# EAGLE design CFT-PB2-smd-revC (EAGLE 5.11)
DRAWN_BY: Alexios; PROJECT_NAME: CFT Mini-Computer; REVISION: Rev B; SHEET_DESCRIPTION: Address Register, Address Bus Drivers & Termination, Autoindex Logic, Device Decoder; SIMULATION_FILENAME: addressing.v; URL: http://www.bedroomlan.org/cft

## Sheet 1 of 6
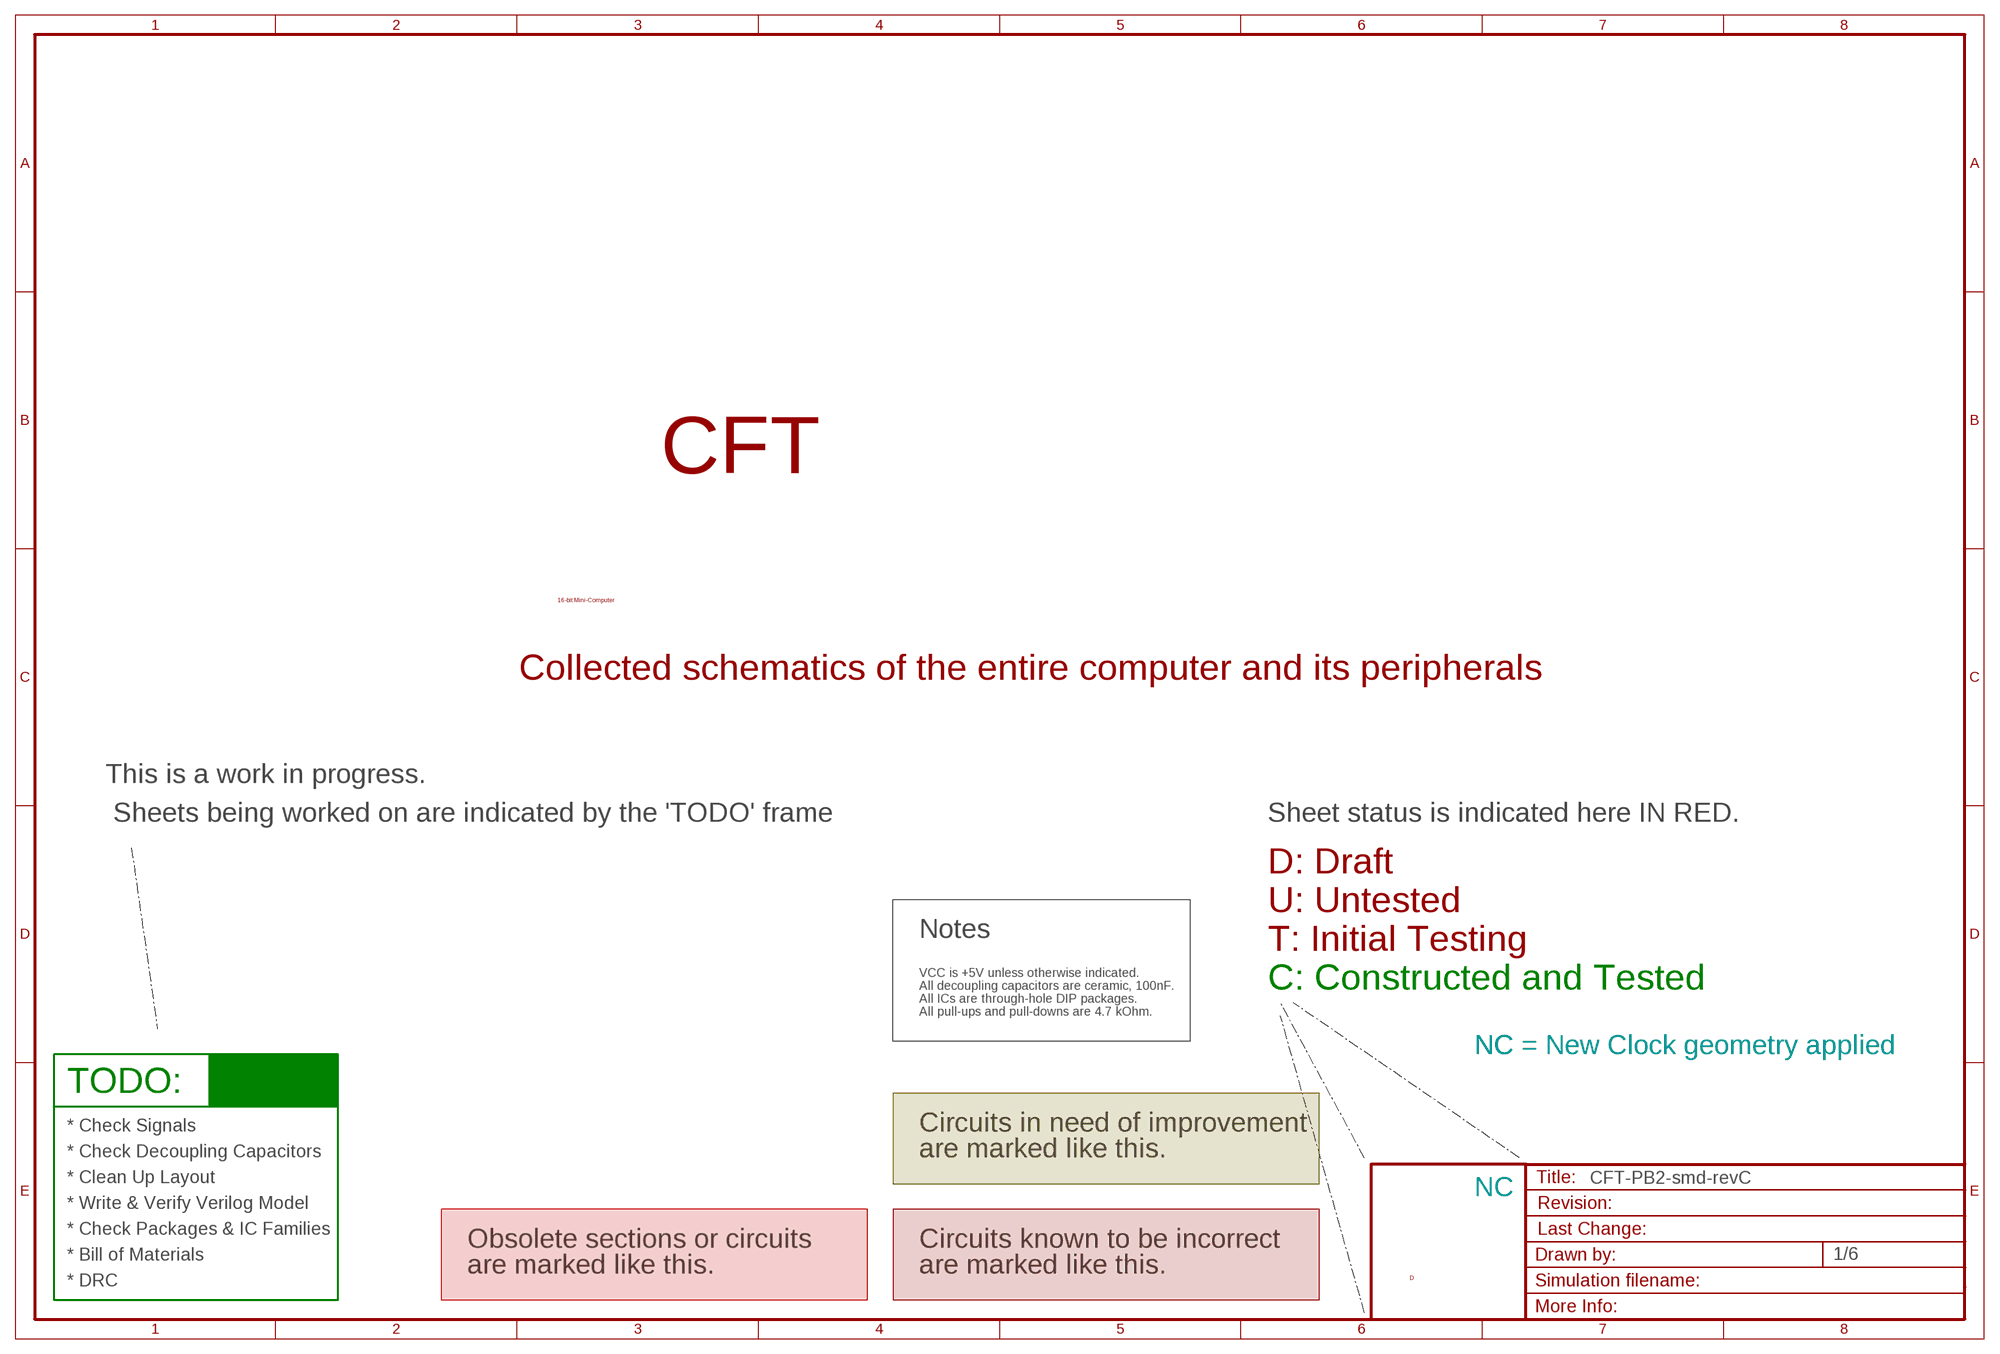
[diagram p0: schematic, sheet 1]

### Notes on the sheet
- CFT
- 16-bit Mini-Computer
- Collected schematics of the entire computer and its peripherals
- This is a work in progress.
- Sheets being worked on are indicated by the 'TODO' frame | Sheet status is indicated here IN RED.
- D: Draft
- U: Untested
- Notes
- T: Initial Testing
- VCC is +5V unless otherwise indicated.
- All decoupling capacitors are ceramic, 100nF. | C: Constructed and Tested
- All ICs are through-hole DIP packages.
- All pull-ups and pull-downs are 4.7 kOhm.
- NC | NC = New Clock geometry applied
- TODO:
- * Check Signals | Circuits in need of improvement
- * Check Decoupling Capacitors | are marked like this.
- * Clean Up Layout
- NC
- * Write & Verify Verilog Model
- * Check Packages & IC Families
- Obsolete sections or circuits | Circuits known to be incorrect
- * Bill of Materials
- are marked like this. | are marked like this.
- D
- * DRC

## Sheet 2 of 6
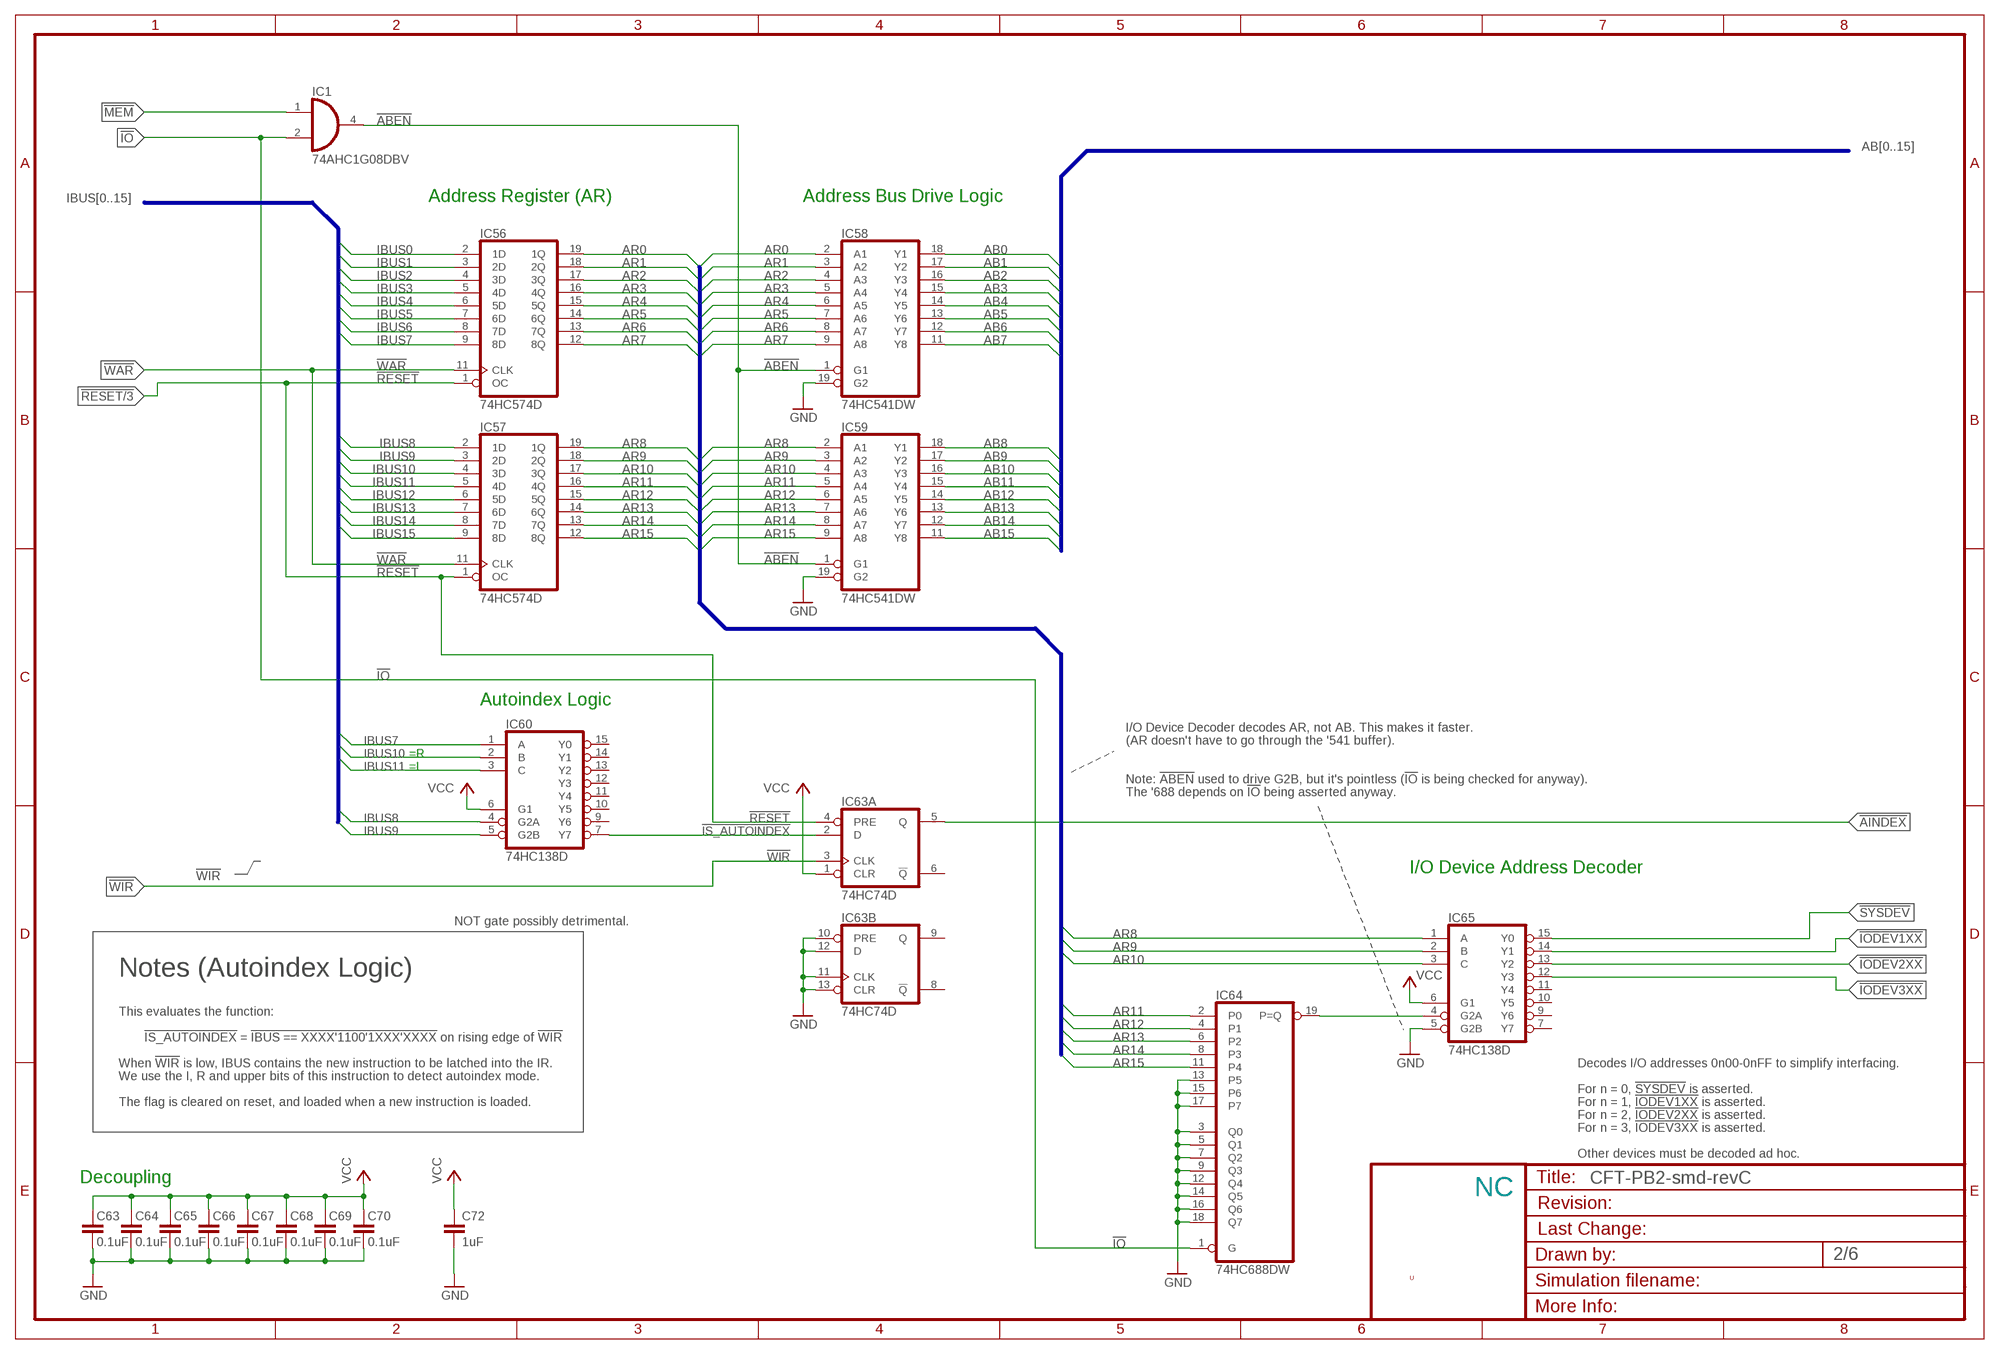
[diagram p1: schematic, sheet 2]

### Parts
C63  0.1uF  C-EUC0805K  [C0805K]
C64  0.1uF  C-EUC0805K  [C0805K]
C65  0.1uF  C-EUC0805K  [C0805K]
C66  0.1uF  C-EUC0805K  [C0805K]
C67  0.1uF  C-EUC0805K  [C0805K]
C68  0.1uF  C-EUC0805K  [C0805K]
C69  0.1uF  C-EUC0805K  [C0805K]
C70  0.1uF  C-EUC0805K  [C0805K]
C72  1uF  C-EUC0805K  [C0805K]
IC1  74AHC1G08DBV  [SOT23-5]
IC56  74HC574D  [SO20W]
IC57  74HC574D  [SO20W]
IC58  74HC541DW  [SO20W]
IC59  74HC541DW  [SO20W]
IC60  74HC138D  [SO16]
IC63  74HC74D  [SO14]
IC64  74HC688DW  [SO20W]
IC65  74HC138D  [SO16]

### Nets
!ABEN: IC1.4(O) IC58.1(G1) IC59.1(G1)
!AINDEX: IC63.5(A:Q)
!IO: IC1.2(I1) IC64.1(G) ; also sheet 6
!IODEV1XX: IC65.14(Y1) ; also sheet 6
!IODEV2XX: IC65.13(Y2) ; also sheet 6
!IODEV3XX: IC65.12(Y3) ; also sheet 6
!IS_AUTOINDEX: IC60.7(Y7) IC63.2(A:D)
!MEM: IC1.1(I0) ; also sheet 6
!RESET: IC56.1(OC) IC57.1(OC) IC63.4(A:PRE) ; also sheet 3,6
!SYSDEV: IC65.15(Y0) ; also sheet 6
!WAR: IC56.11(CLK) IC57.11(CLK) ; also sheet 6
!WIR: IC63.3(A:CLK)
AB0: IC58.18(Y1) ; also sheet 6
AB1: IC58.17(Y2) ; also sheet 6
AB2: IC58.16(Y3) ; also sheet 6
AB3: IC58.15(Y4) ; also sheet 6
AB4: IC58.14(Y5) ; also sheet 6
AB5: IC58.13(Y6) ; also sheet 6
AB6: IC58.12(Y7) ; also sheet 6
AB7: IC58.11(Y8) ; also sheet 6
AB8: IC59.18(Y1) ; also sheet 6
AB9: IC59.17(Y2) ; also sheet 6
AB10: IC59.16(Y3) ; also sheet 6
AB11: IC59.15(Y4) ; also sheet 6
AB12: IC59.14(Y5) ; also sheet 6
AB13: IC59.13(Y6) ; also sheet 6
AB14: IC59.12(Y7) ; also sheet 6
AB15: IC59.11(Y8) ; also sheet 6
AR0: IC56.19(1Q) IC58.2(A1)
AR1: IC56.18(2Q) IC58.3(A2)
AR2: IC56.17(3Q) IC58.4(A3)
AR3: IC56.16(4Q) IC58.5(A4)
AR4: IC56.15(5Q) IC58.6(A5)
AR5: IC56.14(6Q) IC58.7(A6)
AR6: IC56.13(7Q) IC58.8(A7)
AR7: IC56.12(8Q) IC58.9(A8)
AR8: IC57.19(1Q) IC59.2(A1) IC65.1(A)
AR9: IC57.18(2Q) IC59.3(A2) IC65.2(B)
AR10: IC57.17(3Q) IC59.4(A3) IC65.3(C)
AR11: IC57.16(4Q) IC59.5(A4) IC64.2(P0)
AR12: IC57.15(5Q) IC59.6(A5) IC64.4(P1)
AR13: IC57.14(6Q) IC59.7(A6) IC64.6(P2)
AR14: IC57.13(7Q) IC59.8(A7) IC64.8(P3)
AR15: IC57.12(8Q) IC59.9(A8) IC64.11(P4)
GND [low power]: C63.1 C64.1 C65.1 C66.1 C67.1 C68.1 C69.1 C70.1 C72.2 IC58.19(G2) IC59.19(G2) IC63.10(B:PRE) IC63.11(B:CLK) IC63.12(B:D) IC63.13(B:CLR) IC64.3(Q0) IC64.5(Q1) IC64.7(Q2) IC64.9(Q3) IC64.12(Q4) IC64.13(P5) IC64.14(Q5) IC64.15(P6) IC64.16(Q6) IC64.17(P7) IC64.18(Q7) IC65.5(G2B) ; also sheet 3,4,5,6
IBUS0: IC56.2(1D) ; also sheet 3,4,5,6
IBUS1: IC56.3(2D) ; also sheet 3,4,5,6
IBUS2: IC56.4(3D) ; also sheet 3,4,5,6
IBUS3: IC56.5(4D) ; also sheet 3,4,5,6
IBUS4: IC56.6(5D) ; also sheet 3,4,5,6
IBUS5: IC56.7(6D) ; also sheet 3,4,5,6
IBUS6: IC56.8(7D) ; also sheet 3,4,5,6
IBUS7: IC56.9(8D) IC60.1(A) ; also sheet 3,4,5,6
IBUS8: IC57.2(1D) IC60.4(G2A) ; also sheet 3,4,5,6
IBUS9: IC57.3(2D) IC60.5(G2B) ; also sheet 3,4,5,6
IBUS10: IC57.4(3D) IC60.2(B) ; also sheet 3,4,5,6
IBUS11: IC57.5(4D) IC60.3(C) ; also sheet 3,4,5,6
IBUS12: IC57.6(5D) ; also sheet 3,4,5,6
IBUS13: IC57.7(6D) ; also sheet 3,4,5,6
IBUS14: IC57.8(7D) ; also sheet 3,4,5,6
IBUS15: IC57.9(8D) ; also sheet 3,4,5,6
N$95: IC64.19(P=Q) IC65.4(G2A)
VCC [low power]: C63.2 C64.2 C65.2 C66.2 C67.2 C68.2 C69.2 C70.2 C72.1 IC60.6(G1) IC63.1(A:CLR) IC65.6(G1) ; also sheet 3,4,5,6
Unconnected: IC60.9(Y6) IC60.10(Y5) IC60.11(Y4) IC60.12(Y3) IC60.13(Y2) IC60.14(Y1) IC60.15(Y0) IC63.6(A:!Q) IC63.8(B:!Q) IC63.9(B:Q) IC65.7(Y7) IC65.9(Y6) IC65.10(Y5) IC65.11(Y4)

### Buses
AR[0..15]
IBUS[0..15]
AB[0..15]

### Notes on the sheet
- Address Register (AR) | Address Bus Drive Logic
- Autoindex Logic
- I/O Device Decoder decodes AR, not AB. This makes it faster.
- (AR doesn't have to go through the '541 buffer).
- =R
- =I
- Note: !ABEN! used to drive G2B, but it's pointless (!IO! is being checked for anyway).
- The '688 depends on !IO! being asserted anyway.
- I/O Device Address Decoder
- NOT gate possibly detrimental.
- Notes (Autoindex Logic)
- This evaluates the function:
- !IS_AUTOINDEX! = !IBUS == XXXX'1100'1XXX'XXXX! on rising edge of !WIR!
- When !WIR! is low, IBUS contains the new instruction to be latched into the IR. | Decodes I/O addresses 0n00-0nFF to simplify interfacing.
- We use the I, R and upper bits of this instruction to detect autoindex mode.
- For n = 0, !SYSDEV! is asserted.
- The flag is cleared on reset, and loaded when a new instruction is loaded. | For n = 1, !IODEV1XX! is asserted.
- For n = 2, !IODEV2XX! is asserted.
- For n = 3, !IODEV3XX! is asserted.
- Other devices must be decoded ad hoc.
- Decoupling
- NC
- U

## Sheet 3 of 6
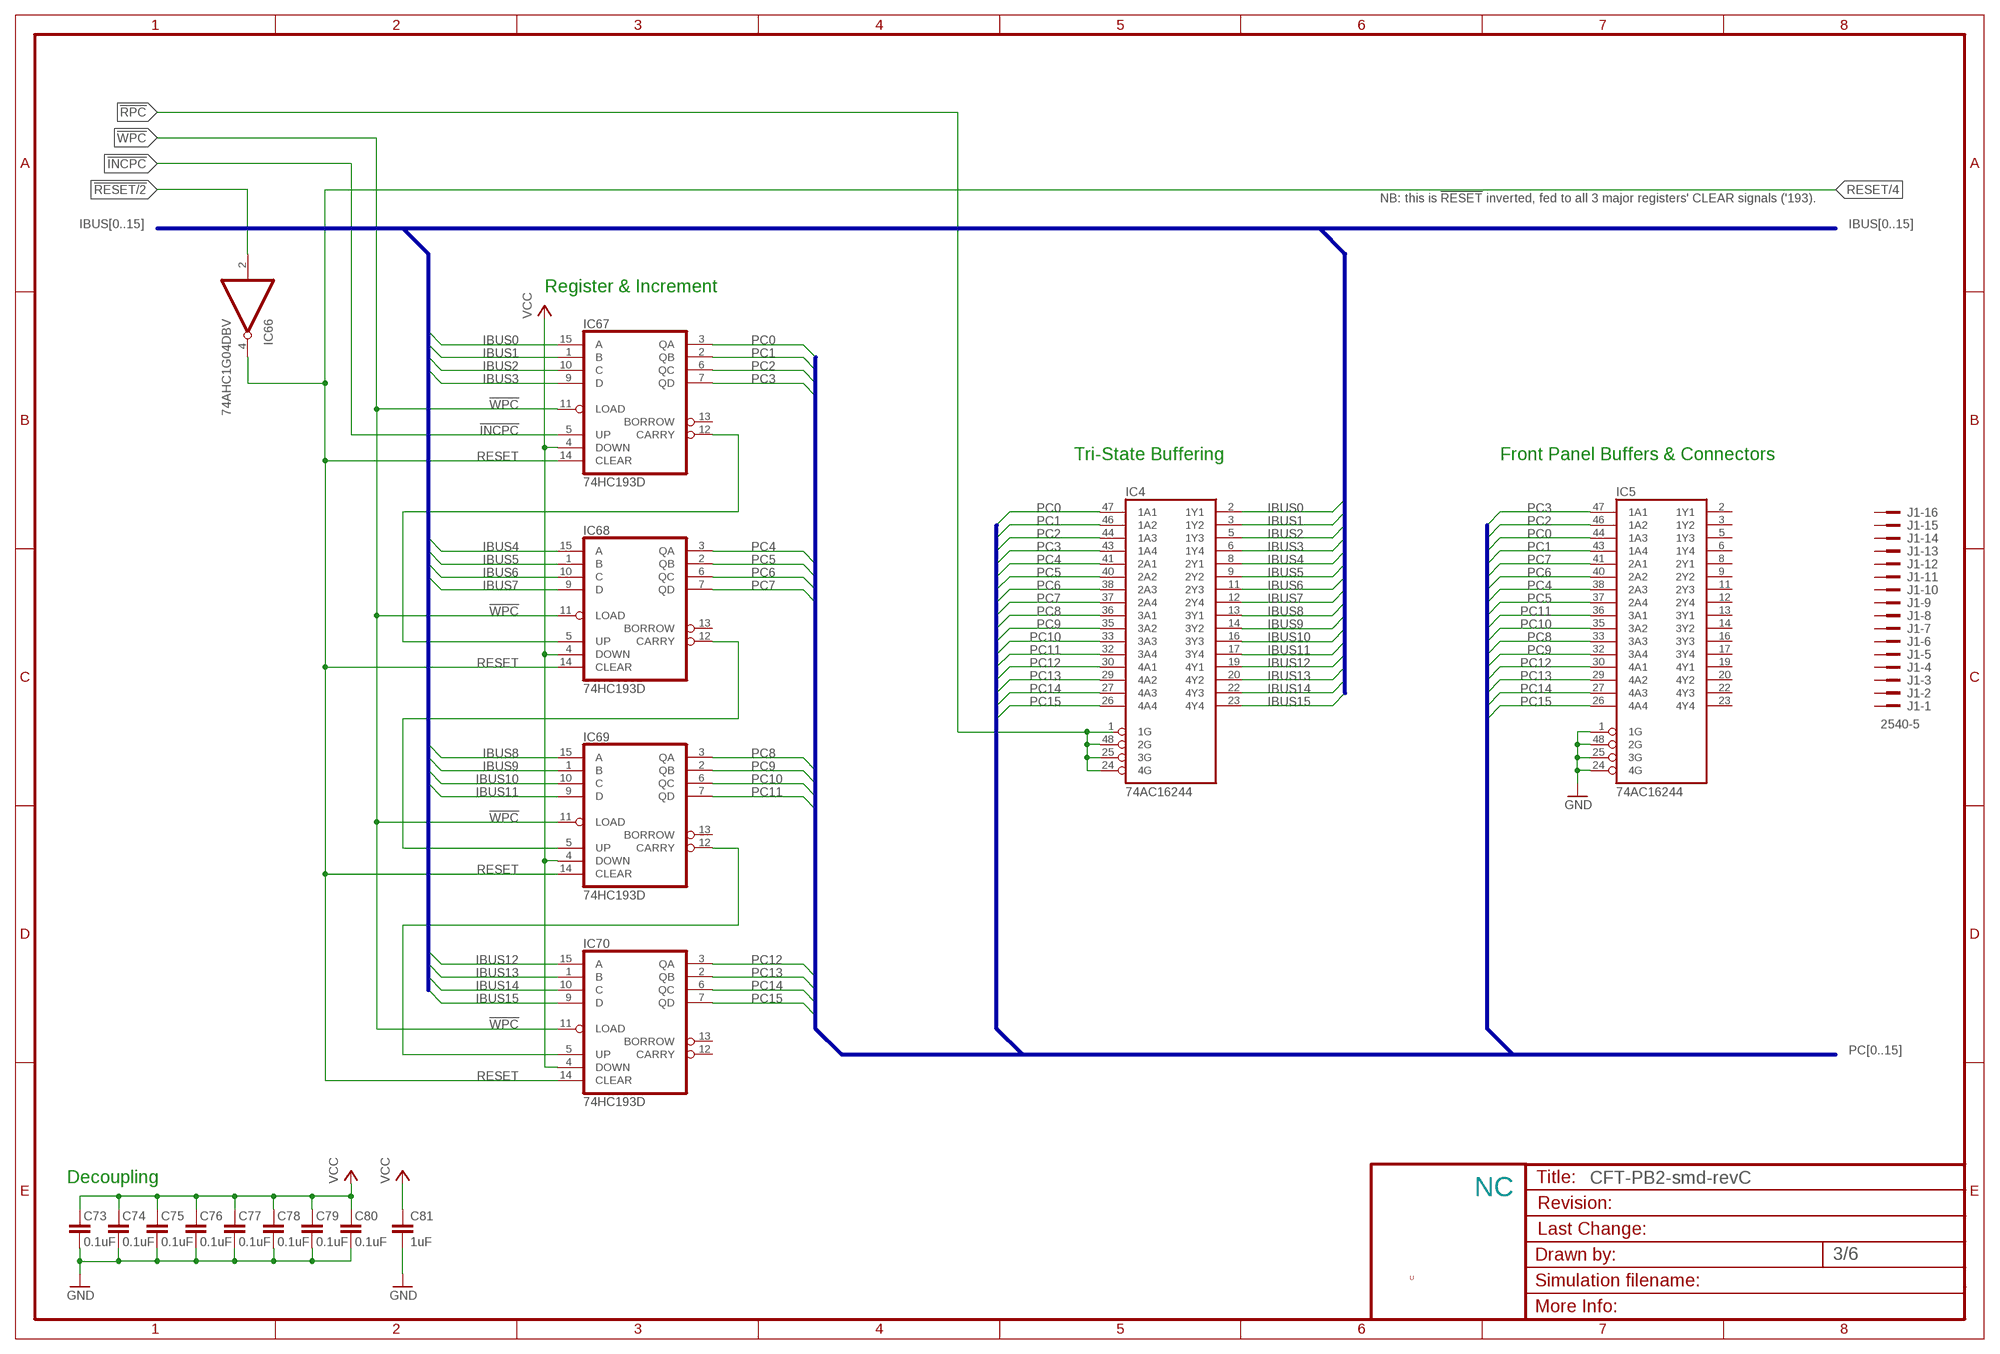
[diagram p2: schematic, sheet 3]

### Parts
C73  0.1uF  C-EUC0805K  [C0805K]
C74  0.1uF  C-EUC0805K  [C0805K]
C75  0.1uF  C-EUC0805K  [C0805K]
C76  0.1uF  C-EUC0805K  [C0805K]
C77  0.1uF  C-EUC0805K  [C0805K]
C78  0.1uF  C-EUC0805K  [C0805K]
C79  0.1uF  C-EUC0805K  [C0805K]
C80  0.1uF  C-EUC0805K  [C0805K]
C81  1uF  C-EUC0805K  [C0805K]
IC4  74AC16244  [SSOP48DL]
IC5  74AC16244  [SSOP48DL]
IC66  74AHC1G04DBV  [SOT23-5]
IC67  74HC193D  [SO16D]
IC68  74HC193D  [SO16D]
IC69  74HC193D  [SO16D]
IC70  74HC193D  [SO16D]
J1  2540-5  [PAK100/2500-5-40]

### Nets
!INCPC: IC67.5(UP) ; also sheet 6
!RESET: IC66.2(I) ; also sheet 2,6
!RPC: IC4.24(4G) IC4.25(3G) IC4.48(2G) ; also sheet 6
!WPC: IC67.11(LOAD) IC68.11(LOAD) IC69.11(LOAD) IC70.11(LOAD) ; also sheet 6
GND [low power]: C73.1 C74.1 C75.1 C76.1 C77.1 C78.1 C79.1 C80.1 C81.2 IC5.1(1G) IC5.24(4G) IC5.25(3G) IC5.48(2G) ; also sheet 2,4,5,6
IBUS0: IC4.2(1Y1) IC67.15(A) ; also sheet 2,4,5,6
IBUS1: IC4.3(1Y2) IC67.1(B) ; also sheet 2,4,5,6
IBUS2: IC4.5(1Y3) IC67.10(C) ; also sheet 2,4,5,6
IBUS3: IC4.6(1Y4) IC67.9(D) ; also sheet 2,4,5,6
IBUS4: IC4.8(2Y1) IC68.15(A) ; also sheet 2,4,5,6
IBUS5: IC4.9(2Y2) IC68.1(B) ; also sheet 2,4,5,6
IBUS6: IC4.11(2Y3) IC68.10(C) ; also sheet 2,4,5,6
IBUS7: IC4.12(2Y4) IC68.9(D) ; also sheet 2,4,5,6
IBUS8: IC4.13(3Y1) IC69.15(A) ; also sheet 2,4,5,6
IBUS9: IC4.14(3Y2) IC69.1(B) ; also sheet 2,4,5,6
IBUS10: IC4.16(3Y3) IC69.10(C) ; also sheet 2,4,5,6
IBUS11: IC4.17(3Y4) IC69.9(D) ; also sheet 2,4,5,6
IBUS12: IC4.19(4Y1) IC70.15(A) ; also sheet 2,4,5,6
IBUS13: IC4.20(4Y2) IC70.1(B) ; also sheet 2,4,5,6
IBUS14: IC4.22(4Y3) IC70.10(C) ; also sheet 2,4,5,6
IBUS15: IC4.23(4Y4) IC70.9(D) ; also sheet 2,4,5,6
N$70: IC67.12(CARRY) IC68.5(UP)
N$71: IC68.12(CARRY) IC69.5(UP)
N$734: IC69.12(CARRY) IC70.5(UP)
PC0: IC4.47(1A1) IC5.44(1A3) IC67.3(QA)
PC1: IC4.46(1A2) IC5.43(1A4) IC67.2(QB)
PC2: IC4.44(1A3) IC5.46(1A2) IC67.6(QC)
PC3: IC4.43(1A4) IC5.47(1A1) IC67.7(QD)
PC4: IC4.41(2A1) IC5.38(2A3) IC68.3(QA)
PC5: IC4.40(2A2) IC5.37(2A4) IC68.2(QB)
PC6: IC4.38(2A3) IC5.40(2A2) IC68.6(QC)
PC7: IC4.37(2A4) IC5.41(2A1) IC68.7(QD)
PC8: IC4.36(3A1) IC5.33(3A3) IC69.3(QA)
PC9: IC4.35(3A2) IC5.32(3A4) IC69.2(QB)
PC10: IC4.33(3A3) IC5.35(3A2) IC69.6(QC) ; also sheet 6
PC11: IC4.32(3A4) IC5.36(3A1) IC69.7(QD) ; also sheet 6
PC12: IC4.30(4A1) IC5.30(4A1) IC70.3(QA) ; also sheet 6
PC13: IC4.29(4A2) IC5.29(4A2) IC70.2(QB) ; also sheet 6
PC14: IC4.27(4A3) IC5.27(4A3) IC70.6(QC) ; also sheet 6
PC15: IC4.26(4A4) IC5.26(4A4) IC70.7(QD) ; also sheet 6
RESET: IC66.4(O) IC67.14(CLEAR) IC68.14(CLEAR) IC69.14(CLEAR) IC70.14(CLEAR) ; also sheet 4,5
VCC [low power]: C73.2 C74.2 C75.2 C76.2 C77.2 C78.2 C79.2 C80.2 C81.1 IC67.4(DOWN) IC68.4(DOWN) IC69.4(DOWN) IC70.4(DOWN) ; also sheet 2,4,5,6
Unconnected: IC4.1(1G) IC5.2(1Y1) IC5.3(1Y2) IC5.5(1Y3) IC5.6(1Y4) IC5.8(2Y1) IC5.9(2Y2) IC5.11(2Y3) IC5.12(2Y4) IC5.13(3Y1) IC5.14(3Y2) IC5.16(3Y3) IC5.17(3Y4) IC5.19(4Y1) IC5.20(4Y2) IC5.22(4Y3) IC5.23(4Y4) IC67.13(BORROW) IC68.13(BORROW) IC69.13(BORROW) IC70.12(CARRY) IC70.13(BORROW) J1.1 J1.2 J1.3 J1.4 J1.5 J1.6 J1.7 J1.8 J1.9 J1.10 J1.11 J1.12 J1.13 J1.14 J1.15 J1.16

### Buses
IBUS[0..15]
PC[0..15]

### Notes on the sheet
- NB: this is !RESET! inverted, fed to all 3 major registers' CLEAR signals ('193).
- Register & Increment
- Tri-State Buffering | Front Panel Buffers & Connectors
- Decoupling
- NC
- U

## Sheet 4 of 6
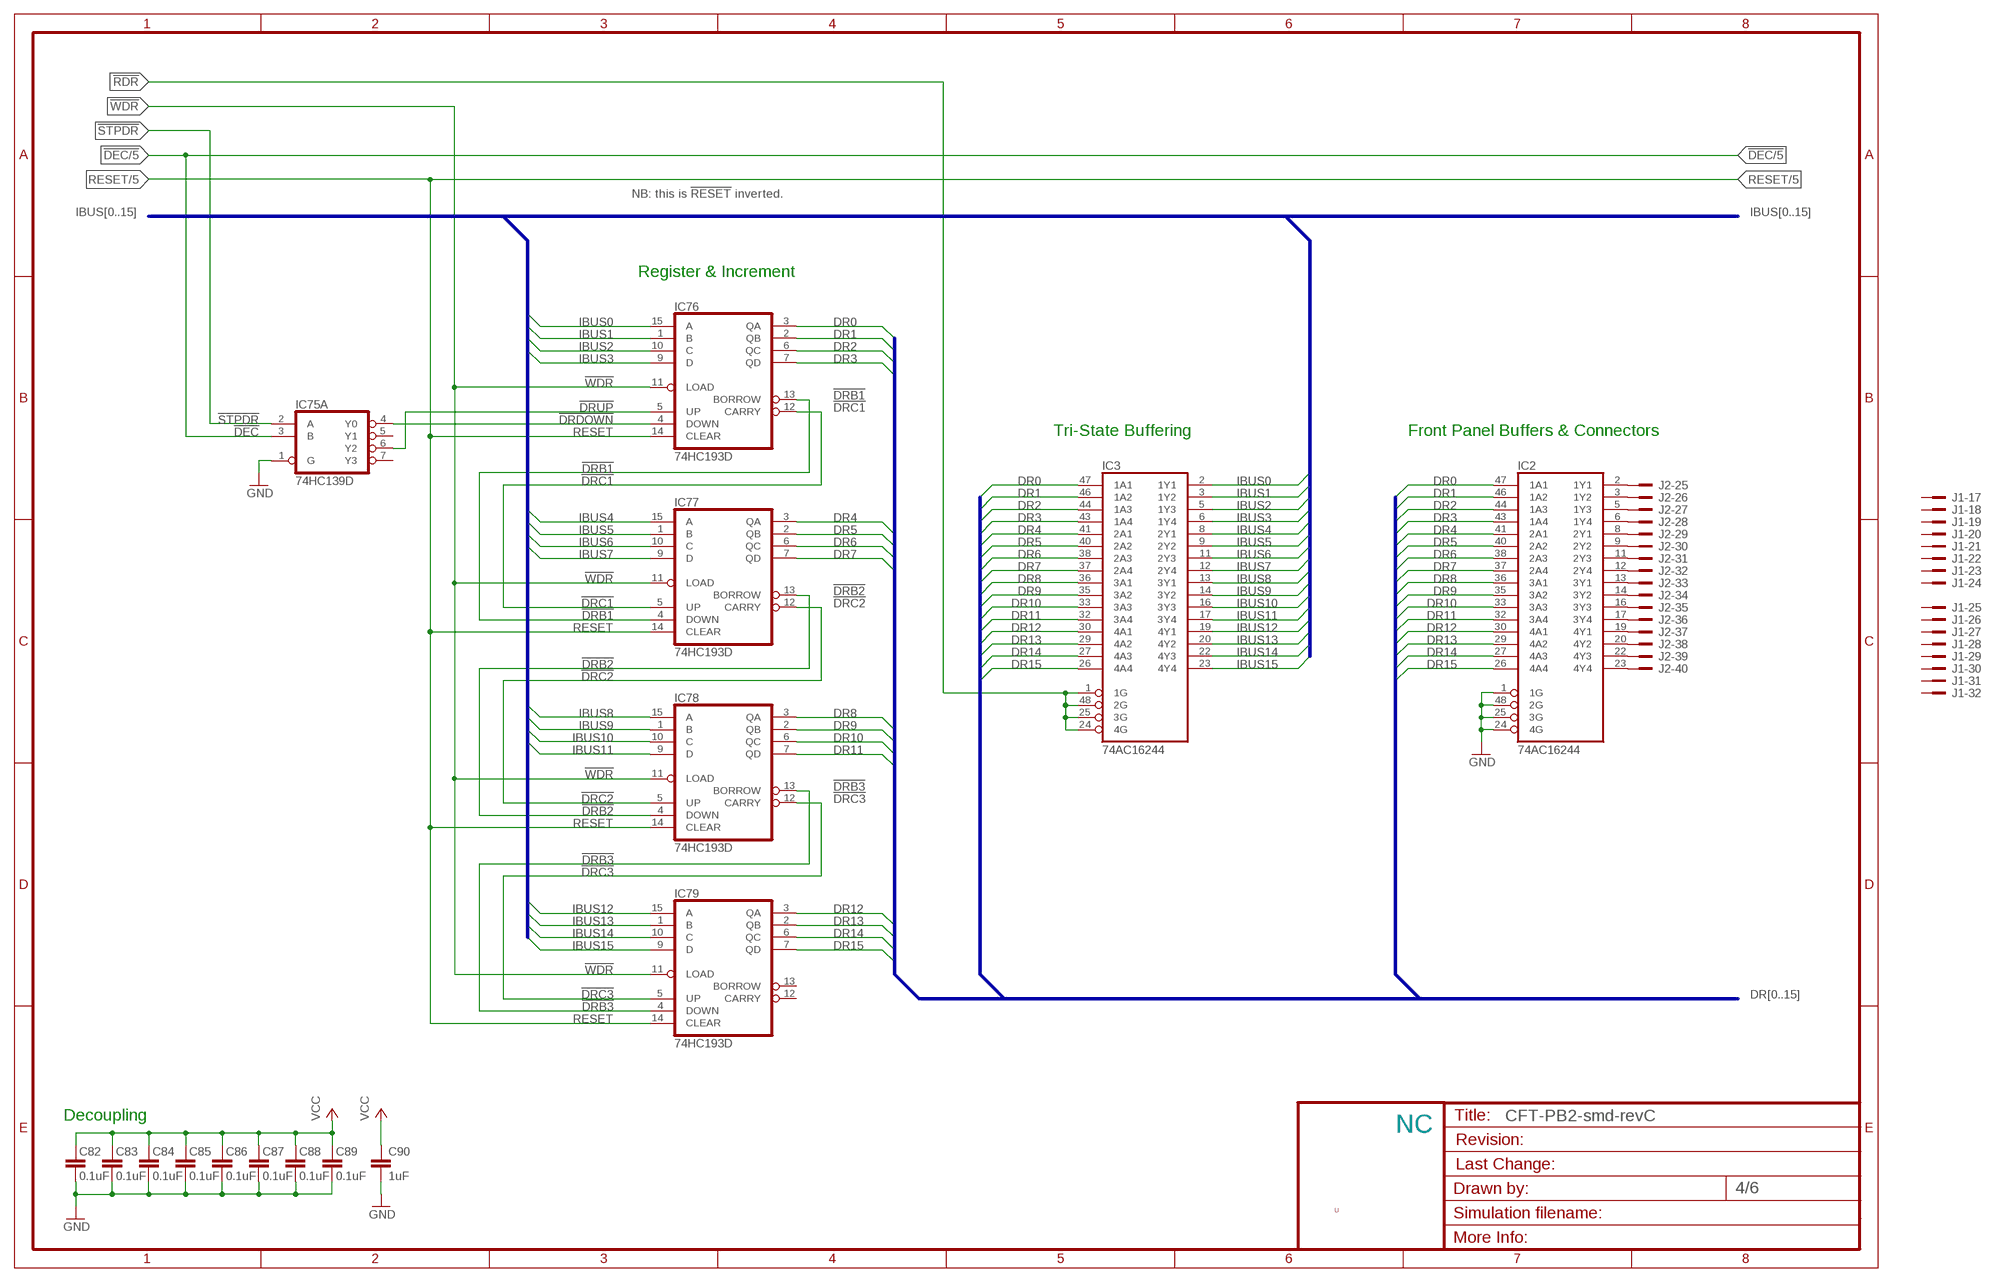
[diagram p3: schematic, sheet 4]

### Parts
C82  0.1uF  C-EUC0805K  [C0805K]
C83  0.1uF  C-EUC0805K  [C0805K]
C84  0.1uF  C-EUC0805K  [C0805K]
C85  0.1uF  C-EUC0805K  [C0805K]
C86  0.1uF  C-EUC0805K  [C0805K]
C87  0.1uF  C-EUC0805K  [C0805K]
C88  0.1uF  C-EUC0805K  [C0805K]
C89  0.1uF  C-EUC0805K  [C0805K]
C90  1uF  C-EUC0805K  [C0805K]
IC2  74AC16244  [SSOP48DL]
IC3  74AC16244  [SSOP48DL]
IC75  74HC139D  [SO16]
IC76  74HC193D  [SO16D]
IC77  74HC193D  [SO16D]
IC78  74HC193D  [SO16D]
IC79  74HC193D  [SO16D]
J2  2540-5  [PAK100/2500-5-40]

### Nets
!DEC: IC75.3(A:B) ; also sheet 5
!DRB1: IC76.13(BORROW) IC77.4(DOWN)
!DRB2: IC77.13(BORROW) IC78.4(DOWN)
!DRB3: IC78.13(BORROW) IC79.4(DOWN)
!DRC1: IC76.12(CARRY) IC77.5(UP)
!DRC2: IC77.12(CARRY) IC78.5(UP)
!DRC3: IC78.12(CARRY) IC79.5(UP)
!DRDOWN: IC75.4(A:Y0) IC76.4(DOWN)
!DRUP: IC75.6(A:Y2) IC76.5(UP)
!RDR: IC3.24(4G) IC3.25(3G) IC3.48(2G) ; also sheet 6
!STPDR: IC75.2(A:A) ; also sheet 6
!WDR: IC76.11(LOAD) IC77.11(LOAD) IC78.11(LOAD) IC79.11(LOAD) ; also sheet 6
DR0: IC2.47(1A1) IC3.47(1A1) IC76.3(QA)
DR1: IC2.46(1A2) IC3.46(1A2) IC76.2(QB)
DR2: IC2.44(1A3) IC3.44(1A3) IC76.6(QC)
DR3: IC2.43(1A4) IC3.43(1A4) IC76.7(QD)
DR4: IC2.41(2A1) IC3.41(2A1) IC77.3(QA)
DR5: IC2.40(2A2) IC3.40(2A2) IC77.2(QB)
DR6: IC2.38(2A3) IC3.38(2A3) IC77.6(QC)
DR7: IC2.37(2A4) IC3.37(2A4) IC77.7(QD)
DR8: IC2.36(3A1) IC3.36(3A1) IC78.3(QA)
DR9: IC2.35(3A2) IC3.35(3A2) IC78.2(QB)
DR10: IC2.33(3A3) IC3.33(3A3) IC78.6(QC)
DR11: IC2.32(3A4) IC3.32(3A4) IC78.7(QD)
DR12: IC2.30(4A1) IC3.30(4A1) IC79.3(QA)
DR13: IC2.29(4A2) IC3.29(4A2) IC79.2(QB)
DR14: IC2.27(4A3) IC3.27(4A3) IC79.6(QC)
DR15: IC2.26(4A4) IC3.26(4A4) IC79.7(QD)
GND [low power]: C82.1 C83.1 C84.1 C85.1 C86.1 C87.1 C88.1 C89.1 C90.2 IC2.1(1G) IC2.24(4G) IC2.25(3G) IC2.48(2G) IC75.1(A:G) ; also sheet 2,3,5,6
IBUS0: IC3.2(1Y1) IC76.15(A) ; also sheet 2,3,5,6
IBUS1: IC3.3(1Y2) IC76.1(B) ; also sheet 2,3,5,6
IBUS2: IC3.5(1Y3) IC76.10(C) ; also sheet 2,3,5,6
IBUS3: IC3.6(1Y4) IC76.9(D) ; also sheet 2,3,5,6
IBUS4: IC3.8(2Y1) IC77.15(A) ; also sheet 2,3,5,6
IBUS5: IC3.9(2Y2) IC77.1(B) ; also sheet 2,3,5,6
IBUS6: IC3.11(2Y3) IC77.10(C) ; also sheet 2,3,5,6
IBUS7: IC3.12(2Y4) IC77.9(D) ; also sheet 2,3,5,6
IBUS8: IC3.13(3Y1) IC78.15(A) ; also sheet 2,3,5,6
IBUS9: IC3.14(3Y2) IC78.1(B) ; also sheet 2,3,5,6
IBUS10: IC3.16(3Y3) IC78.10(C) ; also sheet 2,3,5,6
IBUS11: IC3.17(3Y4) IC78.9(D) ; also sheet 2,3,5,6
IBUS12: IC3.19(4Y1) IC79.15(A) ; also sheet 2,3,5,6
IBUS13: IC3.20(4Y2) IC79.1(B) ; also sheet 2,3,5,6
IBUS14: IC3.22(4Y3) IC79.10(C) ; also sheet 2,3,5,6
IBUS15: IC3.23(4Y4) IC79.9(D) ; also sheet 2,3,5,6
N$16: IC2.2(1Y1) J2.25
N$17: IC2.3(1Y2) J2.26
N$18: IC2.5(1Y3) J2.27
N$19: IC2.6(1Y4) J2.28
N$20: IC2.8(2Y1) J2.29
N$21: IC2.9(2Y2) J2.30
N$22: IC2.11(2Y3) J2.31
N$23: IC2.12(2Y4) J2.32
N$24: IC2.13(3Y1) J2.33
N$25: IC2.14(3Y2) J2.34
N$26: IC2.16(3Y3) J2.35
N$27: IC2.17(3Y4) J2.36
N$28: IC2.19(4Y1) J2.37
N$29: IC2.20(4Y2) J2.38
N$30: IC2.22(4Y3) J2.39
N$31: IC2.23(4Y4) J2.40
RESET: IC76.14(CLEAR) IC77.14(CLEAR) IC78.14(CLEAR) IC79.14(CLEAR) ; also sheet 3,5
VCC [low power]: C82.2 C83.2 C84.2 C85.2 C86.2 C87.2 C88.2 C89.2 C90.1 ; also sheet 2,3,5,6
Unconnected: IC3.1(1G) IC75.5(A:Y1) IC75.7(A:Y3) IC79.12(CARRY) IC79.13(BORROW) J1.17 J1.18 J1.19 J1.20 J1.21 J1.22 J1.23 J1.24 J1.25 J1.26 J1.27 J1.28 J1.29 J1.30 J1.31 J1.32

### Buses
IBUS[0..15]
DR[0..15]

### Notes on the sheet
- NB: this is !RESET! inverted.
- Register & Increment
- Tri-State Buffering | Front Panel Buffers & Connectors
- Decoupling
- NC
- U

## Sheet 5 of 6
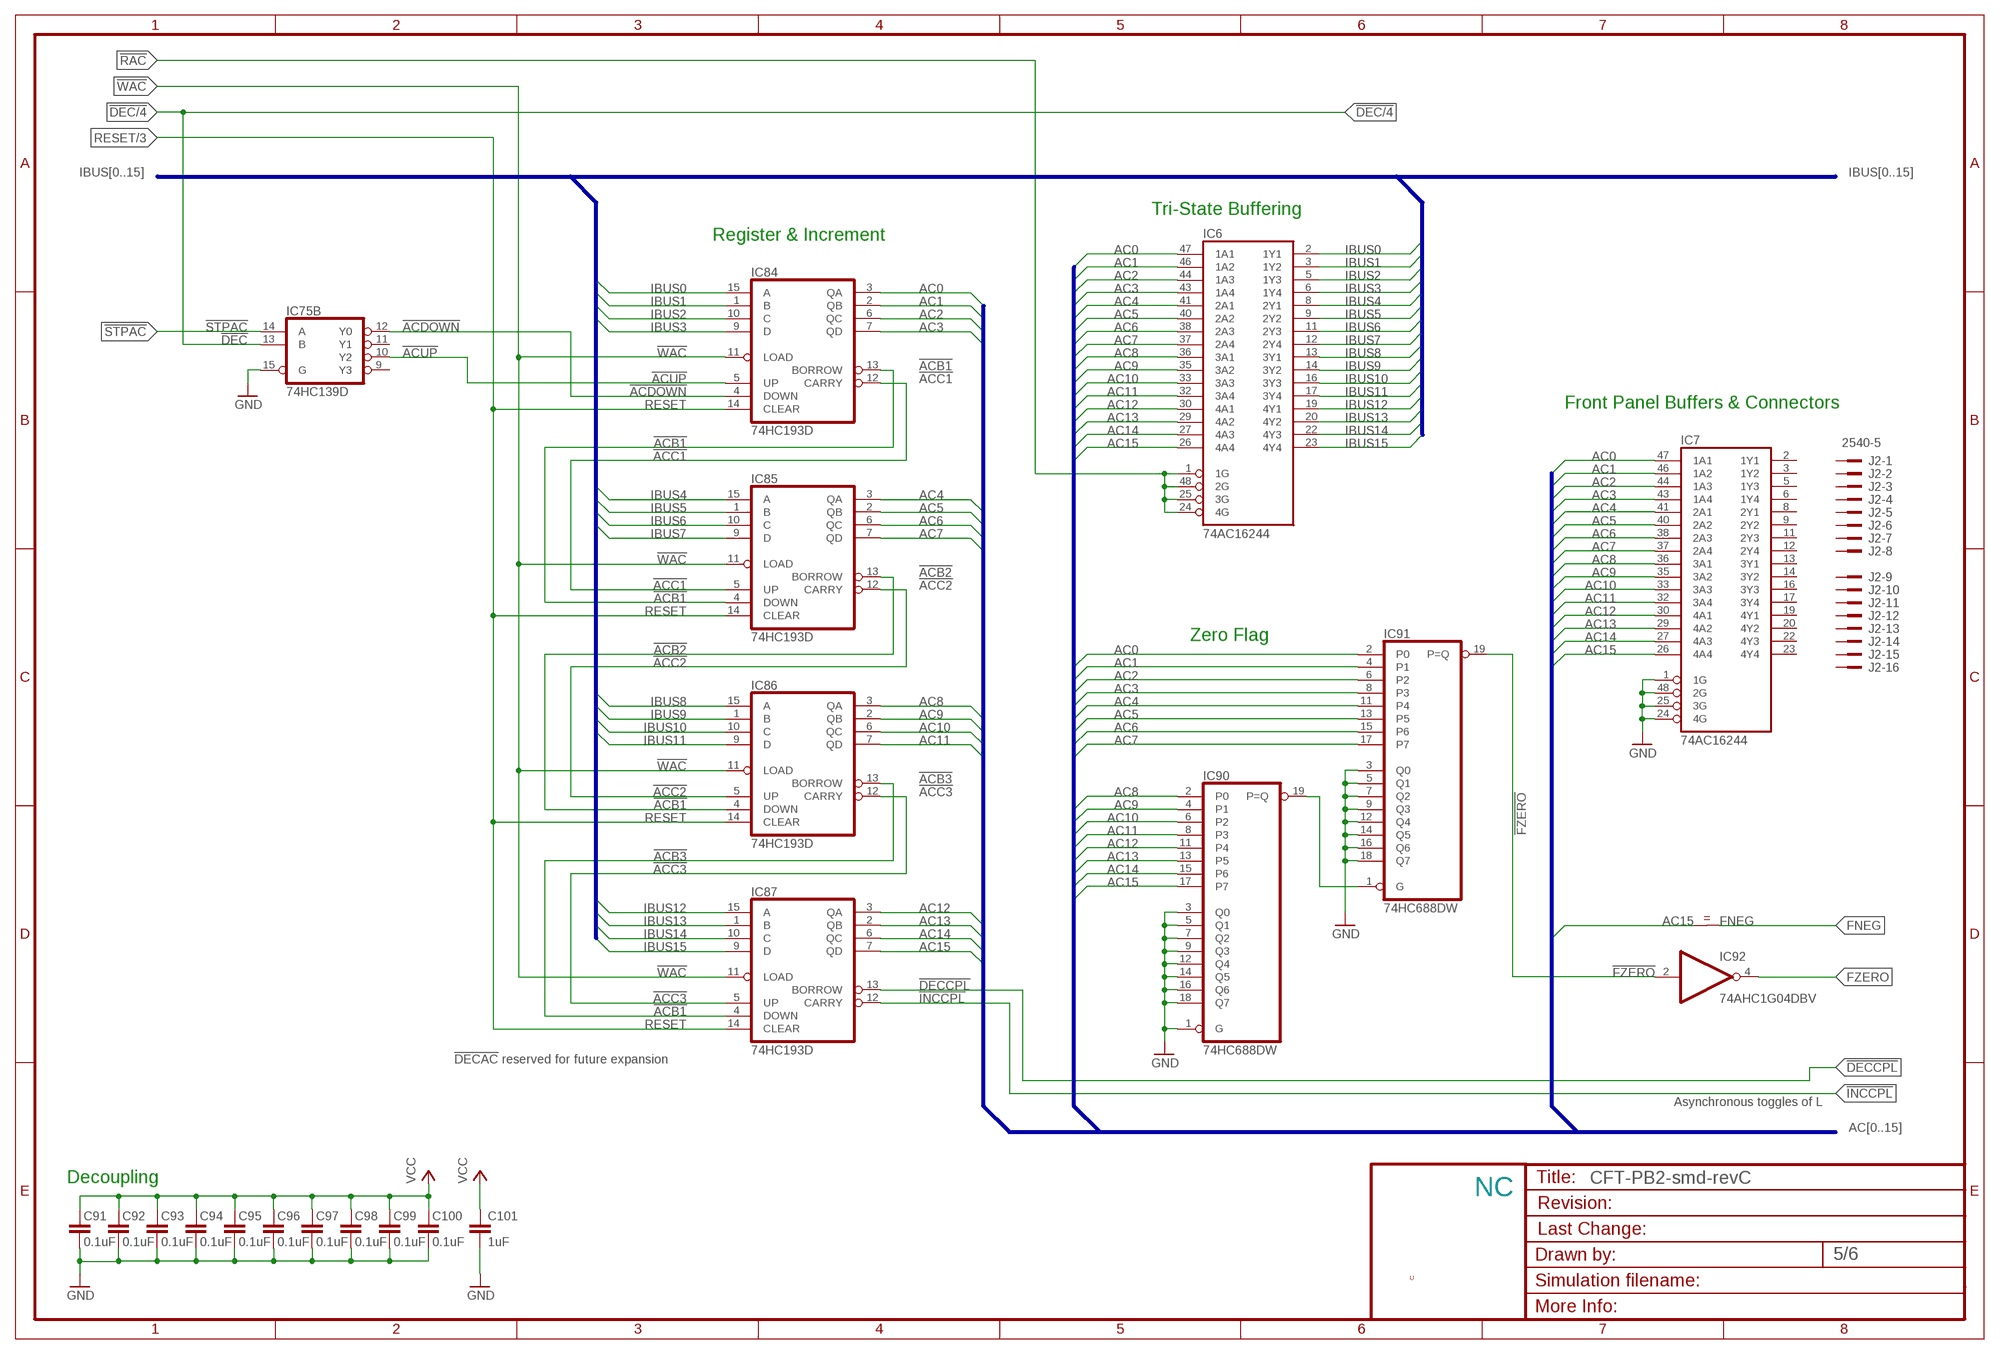
[diagram p4: schematic, sheet 5]

### Parts
C91  0.1uF  C-EUC0805K  [C0805K]
C92  0.1uF  C-EUC0805K  [C0805K]
C93  0.1uF  C-EUC0805K  [C0805K]
C94  0.1uF  C-EUC0805K  [C0805K]
C95  0.1uF  C-EUC0805K  [C0805K]
C96  0.1uF  C-EUC0805K  [C0805K]
C97  0.1uF  C-EUC0805K  [C0805K]
C98  0.1uF  C-EUC0805K  [C0805K]
C99  0.1uF  C-EUC0805K  [C0805K]
C100  0.1uF  C-EUC0805K  [C0805K]
C101  1uF  C-EUC0805K  [C0805K]
IC6  74AC16244  [SSOP48DL]
IC7  74AC16244  [SSOP48DL]
IC84  74HC193D  [SO16D]
IC85  74HC193D  [SO16D]
IC86  74HC193D  [SO16D]
IC87  74HC193D  [SO16D]
IC90  74HC688DW  [SO20W]
IC91  74HC688DW  [SO20W]
IC92  74AHC1G04DBV  [SOT23-5]
X1  SIGNAL-RENAME  [SIGNAL-RENAME]

### Nets
!ACB1: IC84.13(BORROW) IC85.4(DOWN)
!ACB2: IC85.13(BORROW) IC86.4(DOWN)
!ACB3: IC86.13(BORROW) IC87.4(DOWN)
!ACC1: IC84.12(CARRY) IC85.5(UP)
!ACC2: IC85.12(CARRY) IC86.5(UP)
!ACC3: IC86.12(CARRY) IC87.5(UP)
!ACDOWN: IC75.12(B:Y0) IC84.4(DOWN)
!ACUP: IC75.10(B:Y2) IC84.5(UP)
!DEC: IC75.13(B:B) ; also sheet 4
!DECCPL: IC87.13(BORROW) ; also sheet 6
!FZERO: IC91.19(P=Q) IC92.2(I)
!INCCPL: IC87.12(CARRY) ; also sheet 6
!RAC: IC6.24(4G) IC6.25(3G) IC6.48(2G) ; also sheet 6
!STPAC: IC75.14(B:A) ; also sheet 6
!WAC: IC84.11(LOAD) IC85.11(LOAD) IC86.11(LOAD) IC87.11(LOAD) ; also sheet 6
AC0: IC6.47(1A1) IC7.47(1A1) IC84.3(QA) IC91.2(P0) ; also sheet 6
AC1: IC6.46(1A2) IC7.46(1A2) IC84.2(QB) IC91.4(P1) ; also sheet 6
AC2: IC6.44(1A3) IC7.44(1A3) IC84.6(QC) IC91.6(P2) ; also sheet 6
AC3: IC6.43(1A4) IC7.43(1A4) IC84.7(QD) IC91.8(P3) ; also sheet 6
AC4: IC6.41(2A1) IC7.41(2A1) IC85.3(QA) IC91.11(P4) ; also sheet 6
AC5: IC6.40(2A2) IC7.40(2A2) IC85.2(QB) IC91.13(P5) ; also sheet 6
AC6: IC6.38(2A3) IC7.38(2A3) IC85.6(QC) IC91.15(P6) ; also sheet 6
AC7: IC6.37(2A4) IC7.37(2A4) IC85.7(QD) IC91.17(P7) ; also sheet 6
AC8: IC6.36(3A1) IC7.36(3A1) IC86.3(QA) IC90.2(P0) ; also sheet 6
AC9: IC6.35(3A2) IC7.35(3A2) IC86.2(QB) IC90.4(P1) ; also sheet 6
AC10: IC6.33(3A3) IC7.33(3A3) IC86.6(QC) IC90.6(P2) ; also sheet 6
AC11: IC6.32(3A4) IC7.32(3A4) IC86.7(QD) IC90.8(P3) ; also sheet 6
AC12: IC6.30(4A1) IC7.30(4A1) IC87.3(QA) IC90.11(P4) ; also sheet 6
AC13: IC6.29(4A2) IC7.29(4A2) IC87.2(QB) IC90.13(P5) ; also sheet 6
AC14: IC6.27(4A3) IC7.27(4A3) IC87.6(QC) IC90.15(P6) ; also sheet 6
AC15: IC6.26(4A4) IC7.26(4A4) IC87.7(QD) IC90.17(P7) X1.P$1 ; also sheet 6
FNEG: X1.P$2 ; also sheet 6
FZERO: IC92.4(O) ; also sheet 6
GND [low power]: C91.1 C92.1 C93.1 C94.1 C95.1 C96.1 C97.1 C98.1 C99.1 C100.1 C101.2 IC7.1(1G) IC7.24(4G) IC7.25(3G) IC7.48(2G) IC75.15(B:G) IC90.1(G) IC90.3(Q0) IC90.5(Q1) IC90.7(Q2) IC90.9(Q3) IC90.12(Q4) IC90.14(Q5) IC90.16(Q6) IC90.18(Q7) IC91.3(Q0) IC91.5(Q1) IC91.7(Q2) IC91.9(Q3) IC91.12(Q4) IC91.14(Q5) IC91.16(Q6) IC91.18(Q7) ; also sheet 2,3,4,6
IBUS0: IC6.2(1Y1) IC84.15(A) ; also sheet 2,3,4,6
IBUS1: IC6.3(1Y2) IC84.1(B) ; also sheet 2,3,4,6
IBUS2: IC6.5(1Y3) IC84.10(C) ; also sheet 2,3,4,6
IBUS3: IC6.6(1Y4) IC84.9(D) ; also sheet 2,3,4,6
IBUS4: IC6.8(2Y1) IC85.15(A) ; also sheet 2,3,4,6
IBUS5: IC6.9(2Y2) IC85.1(B) ; also sheet 2,3,4,6
IBUS6: IC6.11(2Y3) IC85.10(C) ; also sheet 2,3,4,6
IBUS7: IC6.12(2Y4) IC85.9(D) ; also sheet 2,3,4,6
IBUS8: IC6.13(3Y1) IC86.15(A) ; also sheet 2,3,4,6
IBUS9: IC6.14(3Y2) IC86.1(B) ; also sheet 2,3,4,6
IBUS10: IC6.16(3Y3) IC86.10(C) ; also sheet 2,3,4,6
IBUS11: IC6.17(3Y4) IC86.9(D) ; also sheet 2,3,4,6
IBUS12: IC6.19(4Y1) IC87.15(A) ; also sheet 2,3,4,6
IBUS13: IC6.20(4Y2) IC87.1(B) ; also sheet 2,3,4,6
IBUS14: IC6.22(4Y3) IC87.10(C) ; also sheet 2,3,4,6
IBUS15: IC6.23(4Y4) IC87.9(D) ; also sheet 2,3,4,6
N$793: IC90.19(P=Q) IC91.1(G)
RESET: IC84.14(CLEAR) IC85.14(CLEAR) IC86.14(CLEAR) IC87.14(CLEAR) ; also sheet 3,4
VCC [low power]: C91.2 C92.2 C93.2 C94.2 C95.2 C96.2 C97.2 C98.2 C99.2 C100.2 C101.1 ; also sheet 2,3,4,6
Unconnected: IC6.1(1G) IC7.2(1Y1) IC7.3(1Y2) IC7.5(1Y3) IC7.6(1Y4) IC7.8(2Y1) IC7.9(2Y2) IC7.11(2Y3) IC7.12(2Y4) IC7.13(3Y1) IC7.14(3Y2) IC7.16(3Y3) IC7.17(3Y4) IC7.19(4Y1) IC7.20(4Y2) IC7.22(4Y3) IC7.23(4Y4) IC75.9(B:Y3) IC75.11(B:Y1) J2.1 J2.2 J2.3 J2.4 J2.5 J2.6 J2.7 J2.8 J2.9 J2.10 J2.11 J2.12 J2.13 J2.14 J2.15 J2.16

### Buses
IBUS[0..15]
AC[0..15]

### Notes on the sheet
- Tri-State Buffering
- Register & Increment
- Front Panel Buffers & Connectors
- Zero Flag
- !DECAC! reserved for future expansion
- Asynchronous toggles of L
- Decoupling
- NC
- U

## Sheet 6 of 6
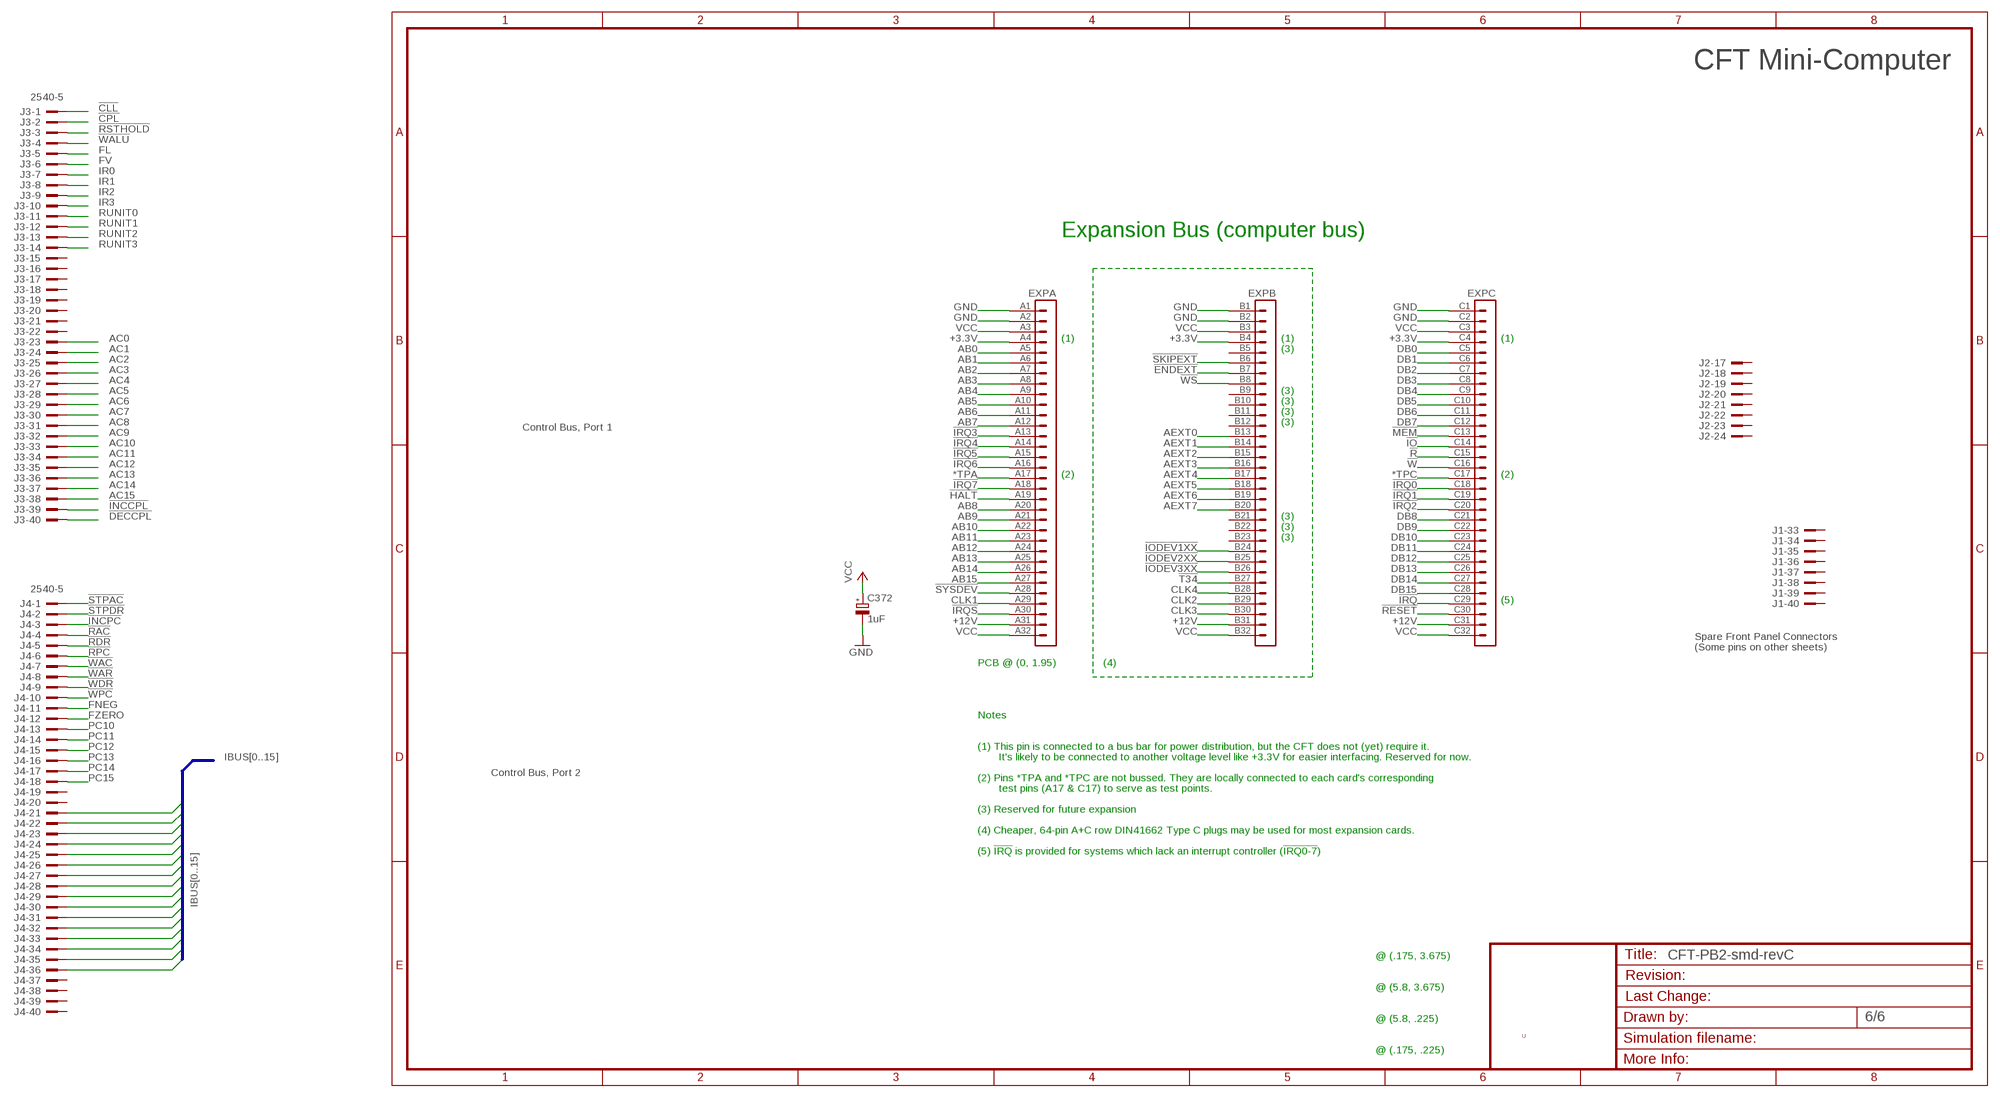
[diagram p5: schematic, sheet 6]

### Parts
C372  1uF  CPOL-EUE2.5-5  [E2,5-5]
EXP  VG96-3K  [VG96K]
J3  2540-5  [PAK100/2500-5-40]
J4  2540-5  [PAK100/2500-5-40]

### Nets
!CLL: J3.1
!CPL: J3.2
!DECCPL: J3.40 ; also sheet 5
!ENDEXT: EXP.B7
!HALT: EXP.A19
!INCCPL: J3.39 ; also sheet 5
!INCPC: J4.3 ; also sheet 3
!IO: EXP.C14 ; also sheet 2
!IODEV1XX: EXP.B24 ; also sheet 2
!IODEV2XX: EXP.B25 ; also sheet 2
!IODEV3XX: EXP.B26 ; also sheet 2
!IRQ: EXP.C29
!IRQ0: EXP.C18
!IRQ1: EXP.C19
!IRQ2: EXP.C20
!IRQ3: EXP.A13
!IRQ4: EXP.A14
!IRQ5: EXP.A15
!IRQ6: EXP.A16
!IRQ7: EXP.A18
!IRQS: EXP.A30
!MEM: EXP.C13 ; also sheet 2
!R: EXP.C15
!RAC: J4.4 ; also sheet 5
!RDR: J4.5 ; also sheet 4
!RESET: EXP.C30 ; also sheet 2,3
!RPC: J4.6 ; also sheet 3
!RSTHOLD: J3.3
!SKIPEXT: EXP.B6
!STPAC: J4.1 ; also sheet 5
!STPDR: J4.2 ; also sheet 4
!SYSDEV: EXP.A28 ; also sheet 2
!T34: EXP.B27
!W: EXP.C16
!WAC: J4.7 ; also sheet 5
!WALU: J3.4
!WAR: J4.8 ; also sheet 2
!WDR: J4.9 ; also sheet 4
!WPC: J4.10 ; also sheet 3
!WS: EXP.B8
*TPA: EXP.A17
*TPC: EXP.C17
+3.3V: EXP.A4 EXP.B4 EXP.C4
+12V [LED power]: EXP.A31 EXP.B31 EXP.C31
AB0: EXP.A5 ; also sheet 2
AB1: EXP.A6 ; also sheet 2
AB2: EXP.A7 ; also sheet 2
AB3: EXP.A8 ; also sheet 2
AB4: EXP.A9 ; also sheet 2
AB5: EXP.A10 ; also sheet 2
AB6: EXP.A11 ; also sheet 2
AB7: EXP.A12 ; also sheet 2
AB8: EXP.A20 ; also sheet 2
AB9: EXP.A21 ; also sheet 2
AB10: EXP.A22 ; also sheet 2
AB11: EXP.A23 ; also sheet 2
AB12: EXP.A24 ; also sheet 2
AB13: EXP.A25 ; also sheet 2
AB14: EXP.A26 ; also sheet 2
AB15: EXP.A27 ; also sheet 2
AC0: J3.23 ; also sheet 5
AC1: J3.24 ; also sheet 5
AC2: J3.25 ; also sheet 5
AC3: J3.26 ; also sheet 5
AC4: J3.27 ; also sheet 5
AC5: J3.28 ; also sheet 5
AC6: J3.29 ; also sheet 5
AC7: J3.30 ; also sheet 5
AC8: J3.31 ; also sheet 5
AC9: J3.32 ; also sheet 5
AC10: J3.33 ; also sheet 5
AC11: J3.34 ; also sheet 5
AC12: J3.35 ; also sheet 5
AC13: J3.36 ; also sheet 5
AC14: J3.37 ; also sheet 5
AC15: J3.38 ; also sheet 5
AEXT0: EXP.B13
AEXT1: EXP.B14
AEXT2: EXP.B15
AEXT3: EXP.B16
AEXT4: EXP.B17
AEXT5: EXP.B18
AEXT6: EXP.B19
AEXT7: EXP.B20
CLK1: EXP.A29
CLK2: EXP.B29
CLK3: EXP.B30
CLK4: EXP.B28
DB0: EXP.C5
DB1: EXP.C6
DB2: EXP.C7
DB3: EXP.C8
DB4: EXP.C9
DB5: EXP.C10
DB6: EXP.C11
DB7: EXP.C12
DB8: EXP.C21
DB9: EXP.C22
DB10: EXP.C23
DB11: EXP.C24
DB12: EXP.C25
DB13: EXP.C26
DB14: EXP.C27
DB15: EXP.C28
FL: J3.5
FNEG: J4.11 ; also sheet 5
FV: J3.6
FZERO: J4.12 ; also sheet 5
GND [low power]: C372.- EXP.A1 EXP.A2 EXP.B1 EXP.B2 EXP.C1 EXP.C2 ; also sheet 2,3,4,5
IBUS0: J4.21 ; also sheet 2,3,4,5
IBUS1: J4.22 ; also sheet 2,3,4,5
IBUS2: J4.23 ; also sheet 2,3,4,5
IBUS3: J4.24 ; also sheet 2,3,4,5
IBUS4: J4.25 ; also sheet 2,3,4,5
IBUS5: J4.26 ; also sheet 2,3,4,5
IBUS6: J4.27 ; also sheet 2,3,4,5
IBUS7: J4.28 ; also sheet 2,3,4,5
IBUS8: J4.29 ; also sheet 2,3,4,5
IBUS9: J4.30 ; also sheet 2,3,4,5
IBUS10: J4.31 ; also sheet 2,3,4,5
IBUS11: J4.32 ; also sheet 2,3,4,5
IBUS12: J4.33 ; also sheet 2,3,4,5
IBUS13: J4.34 ; also sheet 2,3,4,5
IBUS14: J4.35 ; also sheet 2,3,4,5
IBUS15: J4.36 ; also sheet 2,3,4,5
IR0: J3.7
IR1: J3.8
IR2: J3.9
IR3: J3.10
PC10: J4.13 ; also sheet 3
PC11: J4.14 ; also sheet 3
PC12: J4.15 ; also sheet 3
PC13: J4.16 ; also sheet 3
PC14: J4.17 ; also sheet 3
PC15: J4.18 ; also sheet 3
RUNIT0: J3.11
RUNIT1: J3.12
RUNIT2: J3.13
RUNIT3: J3.14
VCC [low power]: C372.+ EXP.A3 EXP.A32 EXP.B3 EXP.B32 EXP.C3 EXP.C32 ; also sheet 2,3,4,5
Unconnected: EXP.B5 EXP.B9 EXP.B10 EXP.B11 EXP.B12 EXP.B21 EXP.B22 EXP.B23 J1.33 J1.34 J1.35 J1.36 J1.37 J1.38 J1.39 J1.40 J2.17 J2.18 J2.19 J2.20 J2.21 J2.22 J2.23 J2.24 J3.15 J3.16 J3.17 J3.18 J3.19 J3.20 J3.21 J3.22 J4.19 J4.20 J4.37 J4.38 J4.39 J4.40

### Buses
IBUS[0..15]

### Notes on the sheet
- CFT Mini-Computer
- Expansion Bus (computer bus)
- (1) | (1) | (1)
- (3)
- (3)
- (3)
- (3)
- (3)
- Control Bus, Port 1
- (2) | (2)
- (3)
- (3)
- (3)
- (5)
- Spare Front Panel Connectors
- (Some pins on other sheets)
- PCB @ (0, 1.95) | (4)
- Notes
- (1) This pin is connected to a bus bar for power distribution, but the CFT does not (yet) require it.
- It's likely to be connected to another voltage level like +3.3V for easier interfacing. Reserved for now.
- Control Bus, Port 2
- (2) Pins *TPA and *TPC are not bussed. They are locally connected to each card's corresponding
- test pins (A17 & C17) to serve as test points.
- (3) Reserved for future expansion
- (4) Cheaper, 64-pin A+C row DIN41662 Type C plugs may be used for most expansion cards.
- (5) !IRQ! is provided for systems which lack an interrupt controller (!IRQ0-7!)
- @ (.175, 3.675)
- @ (5.8, 3.675)
- @ (5.8, .225)
- U
- @ (.175, .225)

## Power pins joined to a net without a drawn wire
GND: IC1.3(GND) IC2.4(GND) IC2.10(GND) IC2.15(GND) IC2.21(GND) IC2.28(GND) IC2.34(GND) IC2.39(GND) IC2.45(GND) IC3.4(GND) IC3.10(GND) IC3.15(GND) IC3.21(GND) IC3.28(GND) IC3.34(GND) IC3.39(GND) IC3.45(GND) IC4.4(GND) IC4.10(GND) IC4.15(GND) IC4.21(GND) IC4.28(GND) IC4.34(GND) IC4.39(GND) IC4.45(GND) IC5.4(GND) IC5.10(GND) IC5.15(GND) IC5.21(GND) IC5.28(GND) IC5.34(GND) IC5.39(GND) IC5.45(GND) IC6.4(GND) IC6.10(GND) IC6.15(GND) IC6.21(GND) IC6.28(GND) IC6.34(GND) IC6.39(GND) IC6.45(GND) IC7.4(GND) IC7.10(GND) IC7.15(GND) IC7.21(GND) IC7.28(GND) IC7.34(GND) IC7.39(GND) IC7.45(GND) IC56.10(GND) IC57.10(GND) IC58.10(GND) IC59.10(GND) IC60.8(GND) IC63.7(P:GND) IC64.10(GND) IC65.8(GND) IC66.3(GND) IC67.8(GND) IC68.8(GND) IC69.8(GND) IC70.8(GND) IC75.8(P:GND) IC76.8(GND) IC77.8(GND) IC78.8(GND) IC79.8(GND) IC84.8(GND) IC85.8(GND) IC86.8(GND) IC87.8(GND) IC90.10(GND) IC91.10(GND) IC92.3(GND)
VCC: IC1.5(VCC) IC2.7(VCC) IC2.18(VCC) IC2.31(VCC) IC2.42(VCC) IC3.7(VCC) IC3.18(VCC) IC3.31(VCC) IC3.42(VCC) IC4.7(VCC) IC4.18(VCC) IC4.31(VCC) IC4.42(VCC) IC5.7(VCC) IC5.18(VCC) IC5.31(VCC) IC5.42(VCC) IC6.7(VCC) IC6.18(VCC) IC6.31(VCC) IC6.42(VCC) IC7.7(VCC) IC7.18(VCC) IC7.31(VCC) IC7.42(VCC) IC56.20(VCC) IC57.20(VCC) IC58.20(VCC) IC59.20(VCC) IC60.16(VCC) IC63.14(P:VCC) IC64.20(VCC) IC65.16(VCC) IC66.5(VCC) IC67.16(VCC) IC68.16(VCC) IC69.16(VCC) IC70.16(VCC) IC75.16(P:VCC) IC76.16(VCC) IC77.16(VCC) IC78.16(VCC) IC79.16(VCC) IC84.16(VCC) IC85.16(VCC) IC86.16(VCC) IC87.16(VCC) IC90.20(VCC) IC91.20(VCC) IC92.5(VCC)

## Library data of the parts
C63-C70 C72-C101 = rcl:C-EU: CAPACITOR, European symbol
C372 = rcl:CPOL-EU: POLARIZED CAPACITOR, European symbol
EXP = alexios-19inch:VG96-3: PCB EUROCARD, 96-pin type C/ABC, 2.54 mm
IC1 = alexios:74*1G08: 2-input AND gate
IC2-IC7 = 74ac-logic:74AC16244: 16-bit BUFFER/LINE DRIVER, 3-state
IC56 IC57 = alexios:74*574: 8-bit D type FLIP FLOP bus driver
IC58 IC59 = alexios:74*541: Octal BUFFER and LINE DRIVER, 3-state
IC60 IC65 = alexios:74*138: 3-line to 8-line DECODER/DEMULTIPLEXER
IC63 = alexios:74*74: Dual D type positive edge triggered FLIP FLOP, preset and clear
IC64 IC90 IC91 = alexios:74*688: 8-bit MAGNITUDE/IDENTITY COMPARATOR, totem pole
IC66 IC92 = alexios:74*1G04: INVERTER Gate
IC67-IC70 IC76-IC79 IC84-IC87 = alexios:74*193: Presettable Synchronous Binary Up/Down Counter Up/down 4-bit binary counter with load and clear inputs, and borrow and carry outputs. Farnell description: <http://uk.farnell.com/nxp/74hct193n/ic-74hct-cmos-74hct193-dip16-5v/dp/382218> Order Code: 382218 Manufacturer Part No: 74HCT193N RoHS : Yes Description: IC, 74HCT CMOS, 74HCT193, DIP16, 5V Counter Type:Binary Clock Frequency:47MHz Count Maximum:15 Supply Voltage Range:4.5V to 5.5V Logic Case Style:DIP No. of Pins:16 Operating Temperature Range:-40°C to +125°C Base Number:74 Clock Frequency Max:43MHz Count Max:16 Counter Measuring Functions:Presettable Synchronous Binary Up / Down Counter Device Marking:74HCT193 IC Generic Number:74HCT193 Logic Function Number:193 Logic IC Base Number:74193 Logic IC Family:HCT Logic IC Function:Presettable Synchronous 4bit Binary Up/Down Counter No. of Gates:1 No. of Inputs:4 Operating Temperature Max:125°C Operating Temperature Min:-40°C Package / Case:DIP Supply Voltage:5V Supply Voltage Max:5.5V Supply Voltage Min:4.5V Termination Type:Through Hole
IC75 = alexios:74*139: Dual 2-line to 4-line DECODER/DEMULTIPLEXER
J1-J4 = con-3m:2540-: 3M (TM) Pak 100 4-Wall Header Source: 3M; OC_FARNELL: 9838414; OC_NEWARK: unknown
X1 = alexios:SIGNAL-RENAME: Connect two signals of different names.

## Net classes
0 default: width 0.152 mm, clearance 0.152 mm
1 low power: width 0.305 mm, clearance 0.152 mm
2 LED power: width 0.406 mm, clearance 0.254 mm

## Board
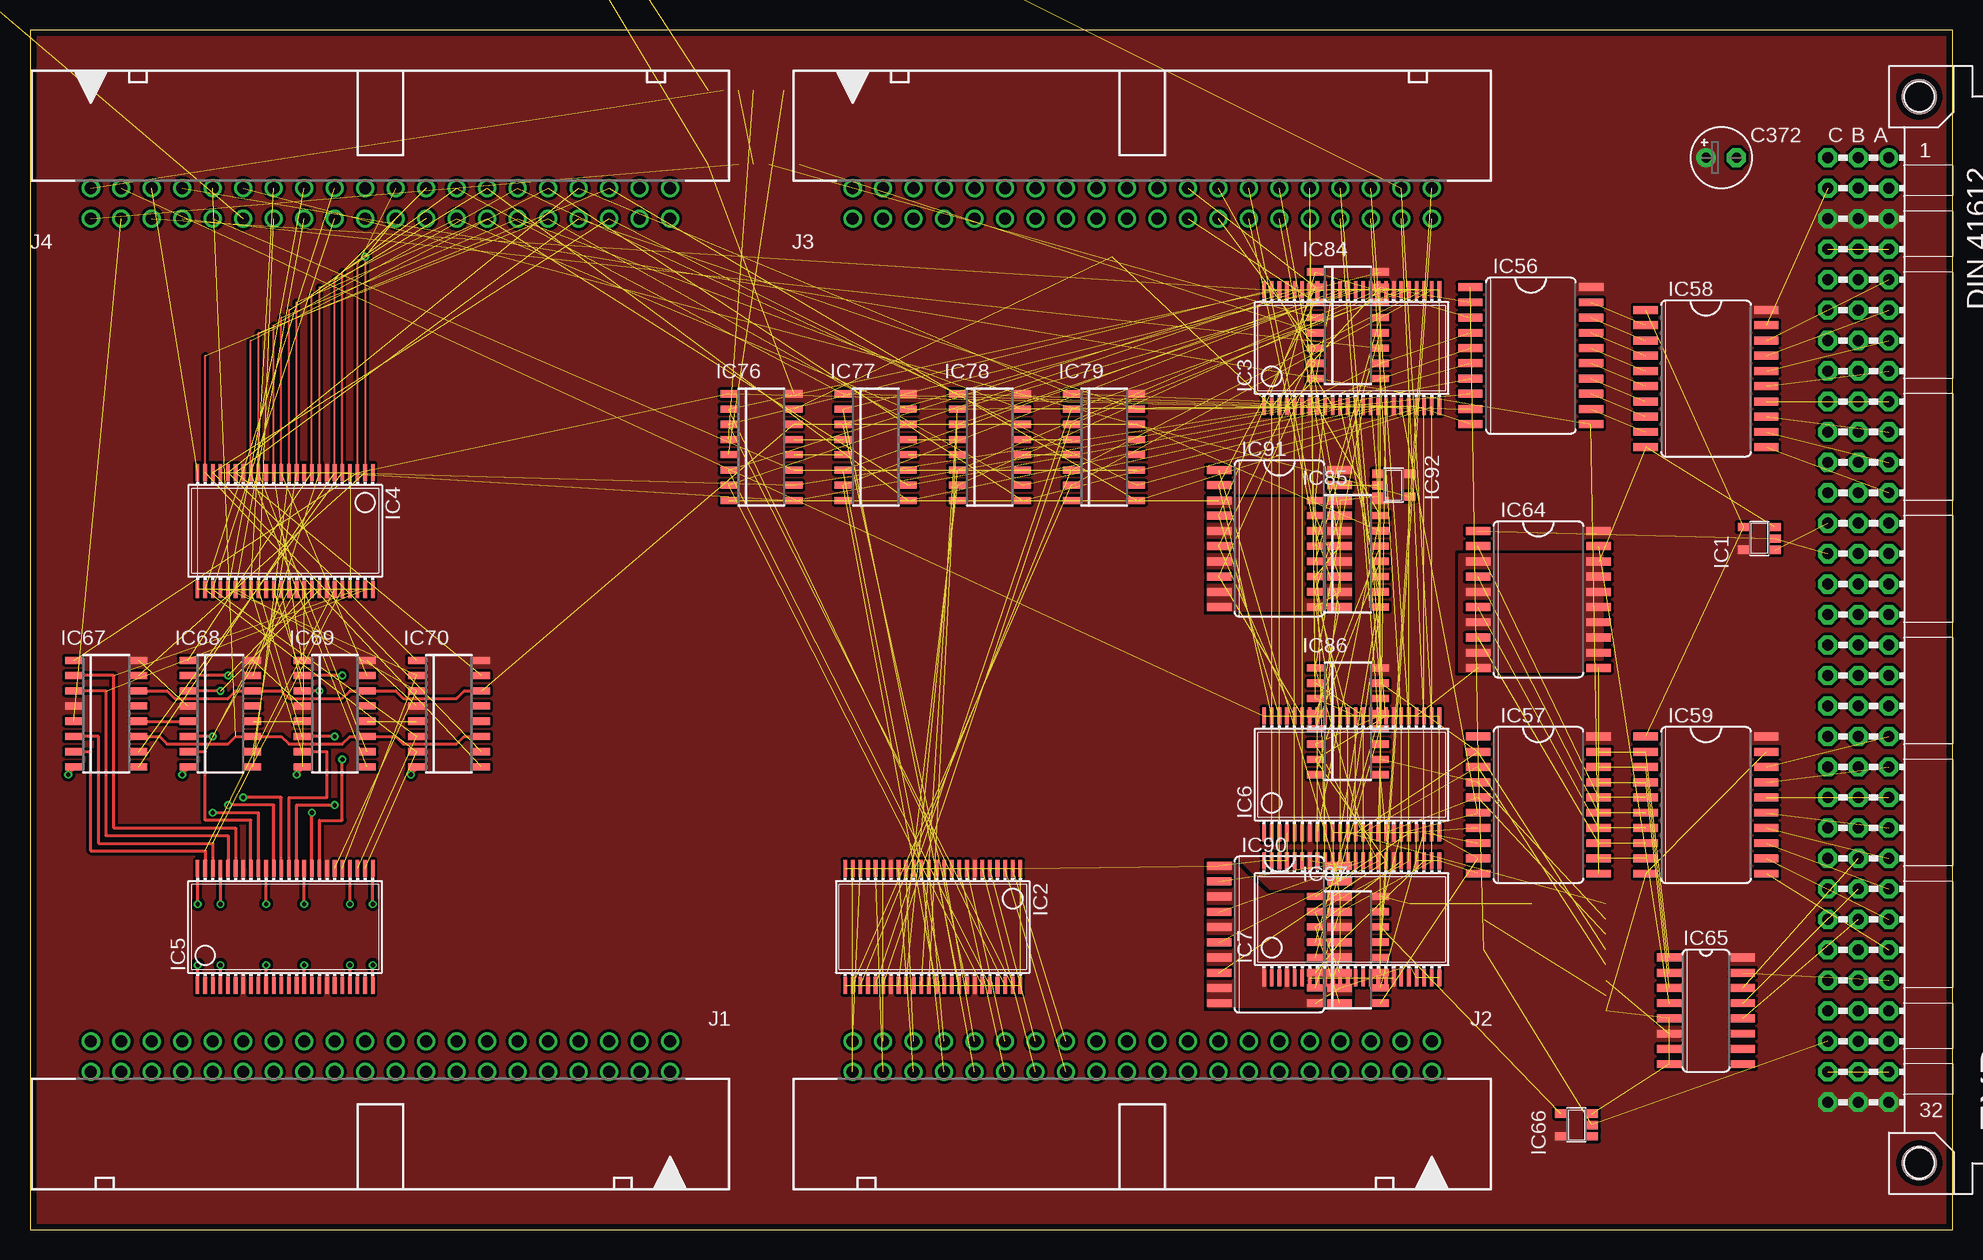
[diagram p6: board, top side]
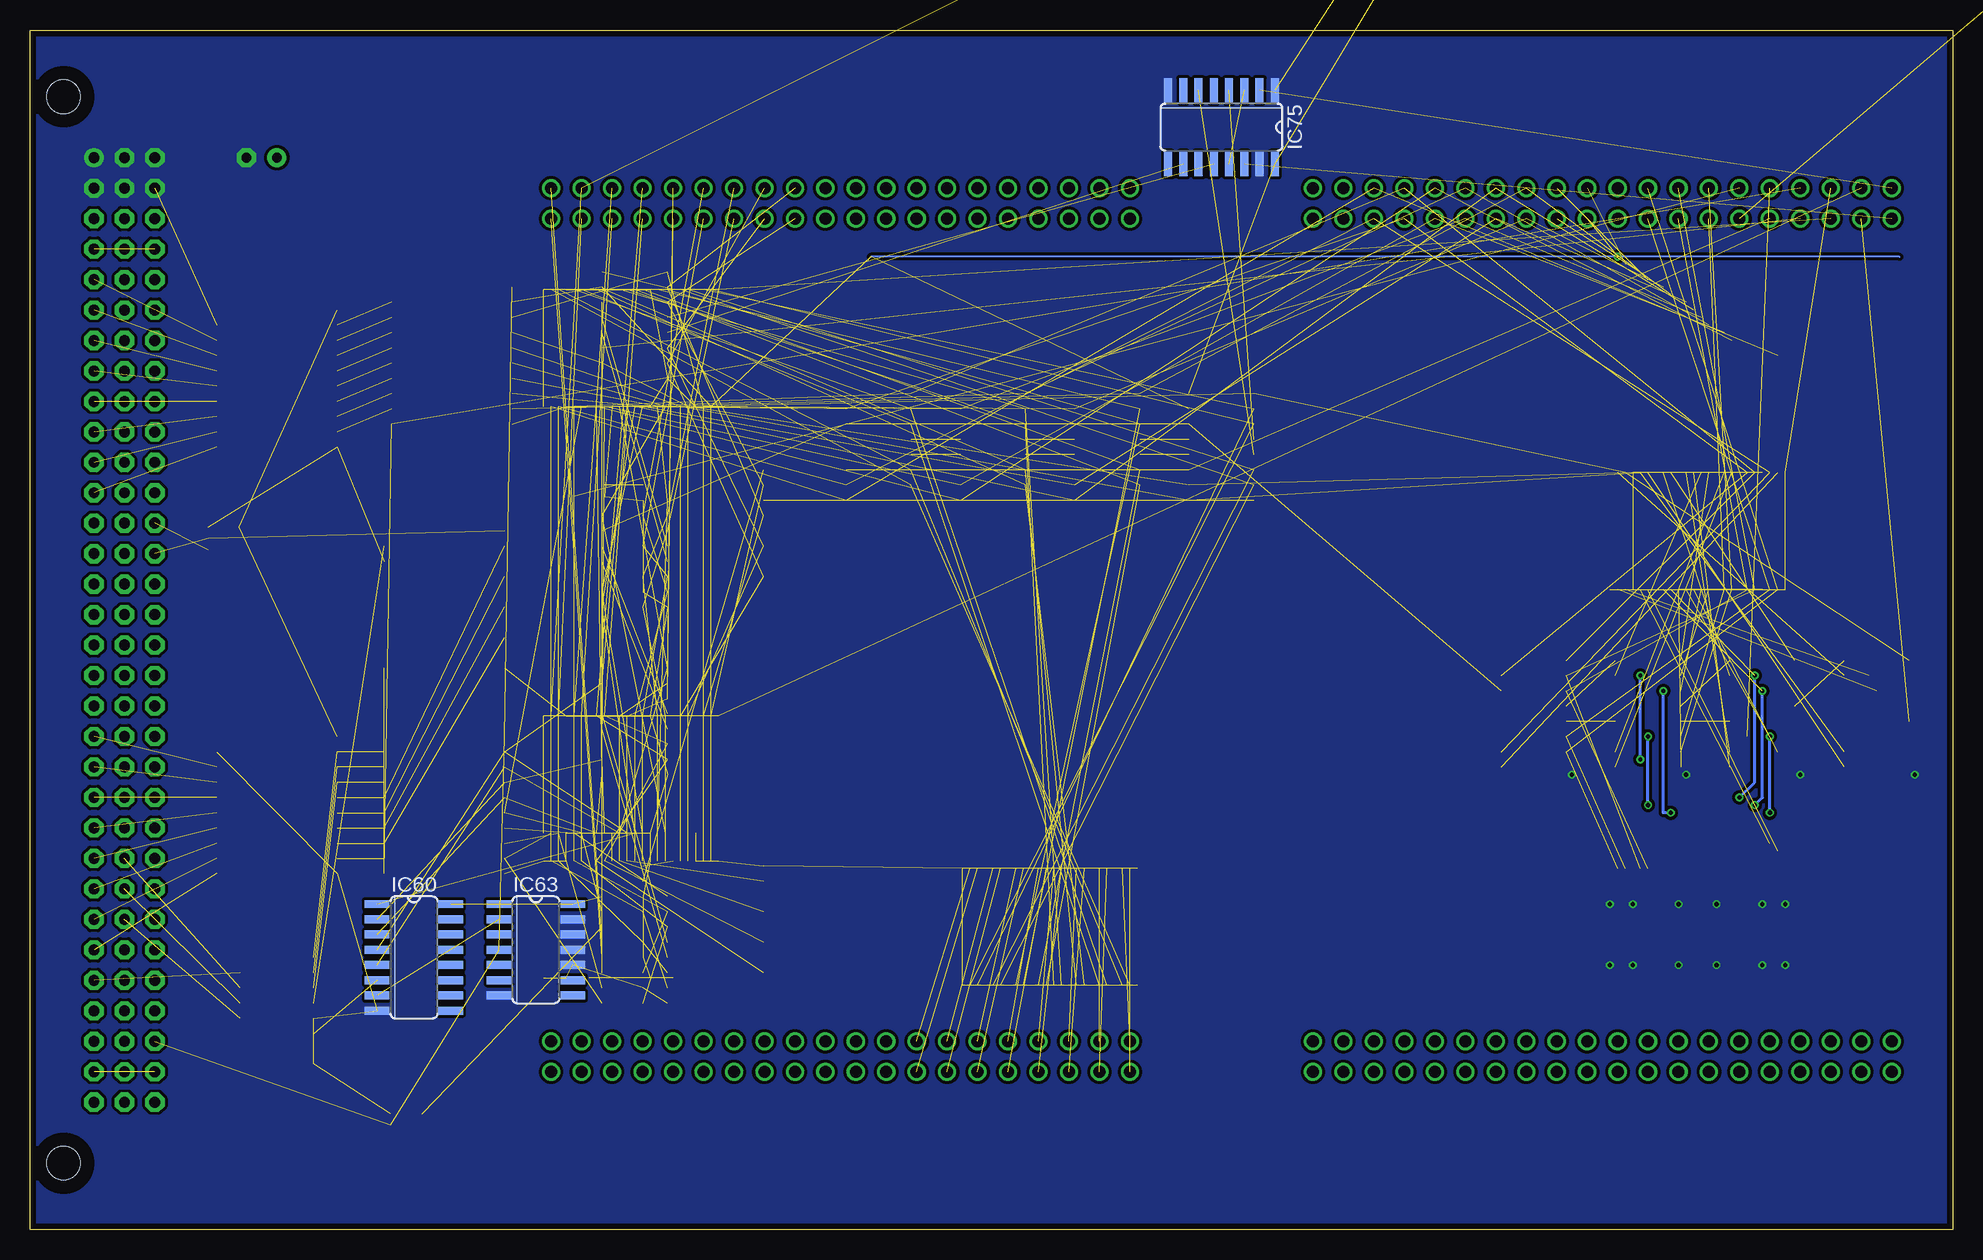
[diagram p7: board, bottom side, seen from below]

Size 160.27 x 100.03 mm. Coordinates in mm from the lower left corner, seen from the top.
Copper layers (1*16): Top 0.035mm / dielectric 1.5mm / Bottom 0.035mm
Design rules "smart-prototyping": minimum track width 7mil, minimum drill 12mil, track to track 7mil, track to pad 7mil, pad to pad 7mil, via to via 7mil, smd to smd 0mil, copper to edge 20mil, drill to drill 10mil, minimum pad ring 10mil, minimum via ring 6mil, stop-mask expansion 2mil, vias tented up to drill 25mil, thermal gap 10mil

### Footprints (pad centres in the part's own frame; a part is rotated, then mirrored left to right if it is on the bottom)
C0805K = smd 1.3 x 1.6: 1 -1,0; 2 1,0
E2,5-5 = drill 0.813 pad 1.6 round: + -1.27,0 | drill 0.813 pad 1.6 octagon: - 1.27,0
VG96K = drill 0.914 pad 1.6 round: A1 154.94,39.37 | drill 0.914 pad 1.6 octagon: A2 154.94,36.83; A3 154.94,34.29; A4 154.94,31.75; A5 154.94,29.21; A6 154.94,26.67; A7 154.94,24.13; A8 154.94,21.59; A9 154.94,19.05; A10 154.94,16.51; A11 154.94,13.97; A12 154.94,11.43; A13 154.94,8.89; A14 154.94,6.35; A15 154.94,3.81; A16 154.94,1.27; A17 154.94,-1.27; A18 154.94,-3.81; A19 154.94,-6.35; A20 154.94,-8.89; A21 154.94,-11.43; A22 154.94,-13.97; A23 154.94,-16.51; A24 154.94,-19.05; A25 154.94,-21.59; A26 154.94,-24.13; A27 154.94,-26.67; A28 154.94,-29.21; A29 154.94,-31.75; A30 154.94,-34.29; A31 154.94,-36.83; A32 154.94,-39.37; B1 152.4,39.37; B2 152.4,36.83; B3 152.4,34.29; B4 152.4,31.75; B5 152.4,29.21; B6 152.4,26.67; B7 152.4,24.13; B8 152.4,21.59; B9 152.4,19.05; B10 152.4,16.51; B11 152.4,13.97; B12 152.4,11.43; B13 152.4,8.89; B14 152.4,6.35; B15 152.4,3.81; B16 152.4,1.27; B17 152.4,-1.27; B18 152.4,-3.81; B19 152.4,-6.35; B20 152.4,-8.89; B21 152.4,-11.43; B22 152.4,-13.97; B23 152.4,-16.51; B24 152.4,-19.05; B25 152.4,-21.59; B26 152.4,-24.13; B27 152.4,-26.67; B28 152.4,-29.21; B29 152.4,-31.75; B30 152.4,-34.29; B31 152.4,-36.83; B32 152.4,-39.37; C1 149.86,39.37; C2 149.86,36.83; C3 149.86,34.29; C4 149.86,31.75; C5 149.86,29.21; C6 149.86,26.67; C7 149.86,24.13; C8 149.86,21.59; C9 149.86,19.05; C10 149.86,16.51; C11 149.86,13.97; C12 149.86,11.43; C13 149.86,8.89; C14 149.86,6.35; C15 149.86,3.81; C16 149.86,1.27; C17 149.86,-1.27; C18 149.86,-3.81; C19 149.86,-6.35; C20 149.86,-8.89; C21 149.86,-11.43; C22 149.86,-13.97; C23 149.86,-16.51; C24 149.86,-19.05; C25 149.86,-21.59; C26 149.86,-24.13; C27 149.86,-26.67; C28 149.86,-29.21; C29 149.86,-31.75; C30 149.86,-34.29; C31 149.86,-36.83; C32 149.86,-39.37 | hole 2.794: 157.48,44.45; 157.48,-44.45
SOT23-5 = smd 0.69 x 0.99: 1 -0.95,-1.29; 2 0,-1.29; 3 0.95,-1.29; 4 0.95,1.3; 5 -0.95,1.3
SSOP48DL = smd 0.305 x 1.422: 1 -6.985,-4.877; 2 -6.35,-4.877; 3 -5.715,-4.877; 4 -5.08,-4.877; 5 -4.445,-4.877; 6 -3.81,-4.877; 7 -3.175,-4.877; 8 -2.54,-4.877; 9 -1.905,-4.877; 10 -1.27,-4.877; 11 -0.635,-4.877; 12 0,-4.877; 13 0.635,-4.877; 14 1.27,-4.877; 15 1.905,-4.877; 16 2.54,-4.877; 17 3.175,-4.877; 18 3.81,-4.877; 19 4.445,-4.877; 20 5.08,-4.877; 21 5.715,-4.877; 22 6.35,-4.877; 23 6.985,-4.877; 24 7.62,-4.877; 25 7.62,4.877; 26 6.985,4.877; 27 6.35,4.877; 28 5.715,4.877; 29 5.08,4.877; 30 4.445,4.877; 31 3.81,4.877; 32 3.175,4.877; 33 2.54,4.877; 34 1.905,4.877; 35 1.27,4.877; 36 0.635,4.877; 37 0,4.877; 38 -0.635,4.877; 39 -1.27,4.877; 40 -1.905,4.877; 41 -2.54,4.877; 42 -3.175,4.877; 43 -3.81,4.877; 44 -4.445,4.877; 45 -5.08,4.877; 46 -5.715,4.877; 47 -6.35,4.877; 48 -6.985,4.877
SO20W = smd 0.66 x 2.032: 1 -5.715,-5.029; 2 -4.445,-5.029; 3 -3.175,-5.029; 4 -1.905,-5.029; 5 -0.635,-5.029; 6 0.635,-5.029; 7 1.905,-5.029; 8 3.175,-5.029; 9 4.445,-5.029; 10 5.715,-5.029; 11 5.715,5.029; 12 4.445,5.029; 13 3.175,5.029; 14 1.905,5.029; 15 0.635,5.029; 16 -0.635,5.029; 17 -1.905,5.029; 18 -3.175,5.029; 19 -4.445,5.029; 20 -5.715,5.029
SO16 = smd 0.66 x 2.032: 1 -4.445,-3.073; 2 -3.175,-3.073; 3 -1.905,-3.073; 4 -0.635,-3.073; 5 0.635,-3.073; 6 1.905,-3.073; 7 3.175,-3.073; 8 4.445,-3.073; 9 4.445,3.073; 10 3.175,3.073; 11 1.905,3.073; 12 0.635,3.073; 13 -0.635,3.073; 14 -1.905,3.073; 15 -3.175,3.073; 16 -4.445,3.073
SO14 = smd 0.66 x 2.032: 1 -3.81,-3.073; 2 -2.54,-3.073; 3 -1.27,-3.073; 4 0,-3.073; 5 1.27,-3.073; 6 2.54,-3.073; 7 3.81,-3.073; 8 3.81,3.073; 9 2.54,3.073; 10 1.27,3.073; 11 0,3.073; 12 -1.27,3.073; 13 -2.54,3.073; 14 -3.81,3.073
SO16D = smd 0.6 x 1.4: 1 -4.445,-2.715; 2 -3.175,-2.715; 3 -1.905,-2.715; 4 -0.635,-2.715; 5 0.635,-2.715; 6 1.905,-2.715; 7 3.175,-2.715; 8 4.445,-2.715; 9 4.445,2.715; 10 3.175,2.715; 11 1.905,2.715; 12 0.635,2.715; 13 -0.635,2.715; 14 -1.905,2.715; 15 -3.175,2.715; 16 -4.445,2.715
PAK100/2500-5-40 = drill 1 pad 1.422 round: 1 -24.13,-1.27; 2 -24.13,1.27; 3 -21.59,-1.27; 4 -21.59,1.27; 5 -19.05,-1.27; 6 -19.05,1.27; 7 -16.51,-1.27; 8 -16.51,1.27; 9 -13.97,-1.27; 10 -13.97,1.27; 11 -11.43,-1.27; 12 -11.43,1.27; 13 -8.89,-1.27; 14 -8.89,1.27; 15 -6.35,-1.27; 16 -6.35,1.27; 17 -3.81,-1.27; 18 -3.81,1.27; 19 -1.27,-1.27; 20 -1.27,1.27; 21 1.27,-1.27; 22 1.27,1.27; 23 3.81,-1.27; 24 3.81,1.27; 25 6.35,-1.27; 26 6.35,1.27; 27 8.89,-1.27; 28 8.89,1.27; 29 11.43,-1.27; 30 11.43,1.27; 31 13.97,-1.27; 32 13.97,1.27; 33 16.51,-1.27; 34 16.51,1.27; 35 19.05,-1.27; 36 19.05,1.27; 37 21.59,-1.27; 38 21.59,1.27; 39 24.13,-1.27; 40 24.13,1.27
SIGNAL-RENAME = smd 0.305 x 0.152: P$1 0,0; P$2 0,0

### Placement (x,y rotation side)
C63  -124.46,199.87 0 top  (outside the outline)
C64  -129.54,199.87 0 top  (outside the outline)
C65  -134.62,199.87 0 top  (outside the outline)
C66  -139.7,199.87 0 top  (outside the outline)
C67  -144.78,199.87 0 top  (outside the outline)
C68  -149.86,199.87 0 top  (outside the outline)
C69  -154.94,199.87 0 top  (outside the outline)
C70  -160.02,199.87 0 top  (outside the outline)
C72  -113.03,208.76 0 top  (outside the outline)
C73  -165.1,199.87 0 top  (outside the outline)
C74  -170.18,199.87 0 top  (outside the outline)
C75  -175.26,199.87 0 top  (outside the outline)
C76  -180.34,199.87 0 top  (outside the outline)
C77  -185.42,199.87 0 top  (outside the outline)
C78  -190.5,199.87 0 top  (outside the outline)
C79  -195.58,199.87 0 top  (outside the outline)
C80  -200.66,199.87 0 top  (outside the outline)
C81  -118.11,208.76 0 top  (outside the outline)
C82  -16.51,208.76 0 top  (outside the outline)
C83  -21.59,208.76 0 top  (outside the outline)
C84  -26.67,208.76 0 top  (outside the outline)
C85  -31.75,208.76 0 top  (outside the outline)
C86  -36.83,208.76 0 top  (outside the outline)
C87  -41.91,208.76 0 top  (outside the outline)
C88  -46.99,208.76 0 top  (outside the outline)
C89  -52.07,208.76 0 top  (outside the outline)
C90  -123.19,208.76 0 top  (outside the outline)
C91  -57.15,208.76 0 top  (outside the outline)
C92  -62.23,208.76 0 top  (outside the outline)
C93  -67.31,208.76 0 top  (outside the outline)
C94  -72.39,208.76 0 top  (outside the outline)
C95  -77.47,208.76 0 top  (outside the outline)
C96  -82.55,208.76 0 top  (outside the outline)
C97  -87.63,208.76 0 top  (outside the outline)
C98  -92.71,208.76 0 top  (outside the outline)
C99  -97.79,208.76 0 top  (outside the outline)
C100  -102.87,208.76 0 top  (outside the outline)
C101  -107.95,208.76 0 top  (outside the outline)
C372  140.97,89.38 0 top
EXP  0,50.01 0 top
IC1  144.15,57.63 90 top
IC2  75.56,25.25 180 top
IC3  109.86,73.51 0 top
IC4  21.59,58.27 180 top
IC5  20.95,25.25 0 top
IC6  109.86,37.95 0 top
IC7  109.86,25.88 0 top
IC56  125.09,72.87 270 top
IC57  125.73,35.41 270 top
IC58  139.7,70.97 270 top
IC59  139.7,35.41 270 top
IC60  128.27,22.71 270 bottom
IC63  118.11,23.34 270 bottom
IC64  125.73,52.55 270 top
IC65  139.7,18.26 270 top
IC66  128.91,8.74 90 top
IC67  6.35,43.03 270 top
IC68  15.88,43.03 270 top
IC69  25.4,43.03 270 top
IC70  34.92,43.03 270 top
IC75  60.96,91.92 180 bottom
IC76  60.96,65.25 270 top
IC77  70.48,65.25 270 top
IC78  80.01,65.25 270 top
IC79  89.53,65.25 270 top
IC84  109.86,75.41 270 top
IC85  109.86,56.36 270 top
IC86  109.86,42.39 270 top
IC87  109.86,23.34 270 top
IC90  104.14,24.61 270 top
IC91  104.14,57.63 270 top
IC92  113.67,62.08 270 top
J1  29.21,14.45 180 top
J2  92.71,14.45 180 top
J3  92.71,85.57 0 top
J4  29.21,85.57 0 top
X1  -127,207.49 0 top  (outside the outline)

### Tracks (layer width: path | path; a pad name or v marks a point on that pad's centre or on a via)
!ABEN  (2 unrouted)
!ACB1  (1 unrouted)
!ACB2  (1 unrouted)
!ACB3  (1 unrouted)
!ACC1  (1 unrouted)
!ACC2  (1 unrouted)
!ACC3  (1 unrouted)
!ACDOWN  (1 unrouted)
!ACUP  (1 unrouted)
!DEC  (1 unrouted)
!DECCPL  (1 unrouted)
!DRB1  (1 unrouted)
!DRB2  (1 unrouted)
!DRB3  (1 unrouted)
!DRC1  (1 unrouted)
!DRC2  (1 unrouted)
!DRC3  (1 unrouted)
!DRDOWN  (1 unrouted)
!DRUP  (1 unrouted)
!FZERO  (1 unrouted)
!INCCPL  (1 unrouted)
!INCPC  (1 unrouted)
!IO  (2 unrouted)
!IODEV1XX  (1 unrouted)
!IODEV2XX  (1 unrouted)
!IODEV3XX  (1 unrouted)
!IS_AUTOINDEX  (1 unrouted)
!MEM  (1 unrouted)
!RAC  (3 unrouted)
!RDR  (3 unrouted)
!RESET  (4 unrouted)
!RPC  (3 unrouted)
!STPAC  (1 unrouted)
!STPDR  (1 unrouted)
!SYSDEV  (1 unrouted)
!WAC  (4 unrouted)
!WAR  (2 unrouted)
!WDR  (4 unrouted)
!WPC  (1 unrouted)
  Top 0.254: IC67.11 10.79,41.12 11.43,40.49 16.51,40.49 17.14,41.12 IC68.11 20.95,41.12 21.59,40.49 26.04,40.49 26.67,41.12 IC69.11 30.48,41.12 31.11,40.49 35.56,40.49 36.2,41.12 IC70.11
+3.3V  (2 unrouted)
+12V  (2 unrouted)
AB0  (1 unrouted)
AB1  (1 unrouted)
AB2  (1 unrouted)
AB3  (1 unrouted)
AB4  (1 unrouted)
AB5  (1 unrouted)
AB6  (1 unrouted)
AB7  (1 unrouted)
AB8  (1 unrouted)
AB9  (1 unrouted)
AB10  (1 unrouted)
AB11  (1 unrouted)
AB12  (1 unrouted)
AB13  (1 unrouted)
AB14  (1 unrouted)
AB15  (1 unrouted)
AC0  (4 unrouted)
AC1  (4 unrouted)
AC2  (4 unrouted)
AC3  (4 unrouted)
AC4  (4 unrouted)
AC5  (4 unrouted)
AC6  (4 unrouted)
AC7  (4 unrouted)
AC8  (4 unrouted)
AC9  (4 unrouted)
AC10  (4 unrouted)
AC11  (4 unrouted)
AC12  (4 unrouted)
AC13  (4 unrouted)
AC14  (4 unrouted)
AC15  (5 unrouted)
AR0  (1 unrouted)
AR1  (1 unrouted)
AR2  (1 unrouted)
AR3  (1 unrouted)
AR4  (1 unrouted)
AR5  (1 unrouted)
AR6  (1 unrouted)
AR7  (1 unrouted)
AR8  (2 unrouted)
AR9  (2 unrouted)
AR10  (2 unrouted)
AR11  (2 unrouted)
AR12  (2 unrouted)
AR13  (2 unrouted)
AR14  (2 unrouted)
AR15  (2 unrouted)
DR0  (2 unrouted)
DR1  (2 unrouted)
DR2  (2 unrouted)
DR3  (2 unrouted)
DR4  (2 unrouted)
DR5  (2 unrouted)
DR6  (2 unrouted)
DR7  (2 unrouted)
DR8  (2 unrouted)
DR9  (2 unrouted)
DR10  (2 unrouted)
DR11  (2 unrouted)
DR12  (2 unrouted)
DR13  (2 unrouted)
DR14  (2 unrouted)
DR15  (2 unrouted)
FNEG  (1 unrouted)
FZERO  (1 unrouted)
GND  (via drill 0.35)  (111 unrouted)
  Top 0.254: v22.86,27.15 IC5.34 | v19.68,27.15 IC5.39 | v15.88,27.15 IC5.45 | v13.97,27.15 IC5.48 | IC68.8 13.16,38.41 v12.7,37.95 | IC67.8 3.63,38.41 v3.17,37.95 | IC69.8 22.68,38.41 v22.23,37.95 | IC70.8 32.21,38.41 v31.75,37.95 | IC5.15 v22.86,22.07 | IC5.10 v19.68,22.07 | IC5.4 v15.88,22.07 | IC5.1 v13.97,22.07 | IC5.21 v26.67,22.07 | IC5.24 v28.57,22.07 | v26.67,27.15 IC5.28 | v28.57,27.15 IC5.25
  pour Bottom (isolate 0.254, rank 6, no thermals): 0,100.18 0,0.48 160.02,0.48 160.02,100.18
  pour Top (isolate 0.254, rank 4, no thermals): 98.17,18.64 110.11,18.64 110.11,27.91 103.12,27.91 100.33,30.58 98.17,30.58
  pour Top (isolate 0.254, rank 4, no thermals): 98.17,51.66 110.11,51.66 110.11,60.93 98.17,60.93
  pour Top (isolate 0.254, rank 4, no thermals): 119.13,46.58 131.06,46.58 131.06,56.24 119.13,56.24
IBUS0  (via drill 0.35)  (7 unrouted)
  Top 0.178: v27.94,81.13 IC4.2
  Bottom 0.178: 4.45,81.13 v27.94,81.13 90.17,81.13
IBUS1  (7 unrouted)
  Top 0.178: IC4.3 27.3,80.49
IBUS2  (7 unrouted)
  Top 0.178: IC4.5 26.04,79.86
IBUS3  (7 unrouted)
  Top 0.178: IC4.6 25.4,79.22
IBUS4  (7 unrouted)
  Top 0.178: IC4.8 24.13,78.59
IBUS5  (7 unrouted)
  Top 0.178: IC4.9 23.5,77.95
IBUS6  (7 unrouted)
  Top 0.178: IC4.11 22.23,77.32
IBUS7  (8 unrouted)
  Top 0.178: IC4.12 21.59,76.68
IBUS8  (8 unrouted)
  Top 0.178: IC4.13 20.95,76.05
IBUS9  (8 unrouted)
  Top 0.178: IC4.14 20.32,75.41
IBUS10  (8 unrouted)
  Top 0.178: IC4.16 19.05,74.78
IBUS11  (8 unrouted)
  Top 0.178: IC4.17 18.41,74.14
IBUS12  (7 unrouted)
IBUS13  (7 unrouted)
IBUS14  (7 unrouted)
IBUS15  (7 unrouted)
  Top 0.178: IC4.23 14.61,72.87
N$16  (1 unrouted)
N$17  (1 unrouted)
N$18  (1 unrouted)
N$19  (1 unrouted)
N$20  (1 unrouted)
N$21  (1 unrouted)
N$22  (1 unrouted)
N$23  (1 unrouted)
N$24  (1 unrouted)
N$25  (1 unrouted)
N$26  (1 unrouted)
N$27  (1 unrouted)
N$28  (1 unrouted)
N$29  (1 unrouted)
N$30  (1 unrouted)
N$31  (1 unrouted)
N$70
  Top 0.254: IC67.12 IC68.5
N$71  (1 unrouted)
N$95  (1 unrouted)
N$734  (1 unrouted)
N$793  (1 unrouted)
PC0  (1 unrouted)
  Top 0.254: IC67.3 6.35,44.93 6.35,32.87 16.51,32.87 IC5.44
PC1  (1 unrouted)
  Top 0.254: IC67.2 6.99,46.2 6.99,33.5 17.14,33.5 IC5.43
PC2  (1 unrouted)
  Top 0.254: IC67.6 5.71,41.12 5.71,32.23 15.24,32.23 IC5.46
PC3  (1 unrouted)
  Top 0.254: IC67.7 5.08,39.85 5.08,31.6 14.61,31.6 IC5.47
PC4  (via drill 0.35)  (1 unrouted)
  Top 0.254: IC5.38 20.32,35.41 v16.51,35.41 | v15.88,44.93 IC68.3
  Bottom 0.254: v16.51,35.41 15.88,36.04 v15.88,44.93
PC5  (via drill 0.35)  (1 unrouted)
  Top 0.254: IC5.37 20.95,36.04 v17.78,36.04 | v16.51,46.2 IC68.2
  Bottom 0.254: v17.78,36.04 16.51,37.31 v16.51,46.2
PC6  (via drill 0.35)  (1 unrouted)
  Top 0.254: v15.24,41.12 IC68.6 | v15.24,34.77 19.05,34.77 IC5.40
  Bottom 0.254: v15.24,34.77 v15.24,41.12
PC7  (1 unrouted)
  Top 0.254: IC68.7 14.61,39.85 14.61,34.14 18.41,34.14 IC5.41
PC8  (via drill 0.35)  (1 unrouted)
  Top 0.254: IC5.33 v23.5,34.77 | v24.13,44.93 IC69.3
  Bottom 0.254: v23.5,34.77 24.13,34.77 v24.13,44.93
PC9  (via drill 0.35)  (1 unrouted)
  Top 0.254: IC5.32 24.13,34.14 26.04,34.14 v26.04,39.22 | v26.04,46.2 IC69.2
  Bottom 0.254: v26.04,39.22 v26.04,46.2
PC10  (via drill 0.35)  (2 unrouted)
  Top 0.254: IC5.35 22.23,35.41 v25.4,35.41 | v25.4,41.12 IC69.6
  Bottom 0.254: v25.4,35.41 v25.4,41.12
PC11  (2 unrouted)
  Top 0.254: IC5.36 21.59,36.04 24.77,36.04 24.77,39.85 IC69.7
PC12  (3 unrouted)
PC13  (3 unrouted)
PC14  (3 unrouted)
PC15  (3 unrouted)
RESET  (9 unrouted)
  Top 0.254: IC67.14 11.43,44.93 12.06,44.3 16.51,44.3 17.14,44.93 IC68.14 20.95,44.93 21.59,44.3 26.04,44.3 26.67,44.93 IC69.14 30.48,44.93 31.11,44.3 35.56,44.3 36.2,44.93 IC70.14
VCC  (50 unrouted)
  pour Top (isolate 0.254, rank 6, no thermals): 0,100.18 0,0.48 160.02,0.48 160.02,100.18